# Altium project Cortes.PrjPcb (part 2 of 3)

## Sheet Trinamic.SchDoc
size 420 x 297 mm; SheetNumber: 8; SheetTotal: 10; PageSetup: Record=PageOptions|CenterHorizontal=True|CenterVertical=True|PrintScale=0.96|XCorrection=1.00|YCorrection=1.00|PrintKind=1|BorderSize=5000000|LeftOffset=0|BottomOffset=0|Orientation=2|PaperLength=4318|PaperWidth=2794|Scale=100|PaperSource=7|PrintQuality=600|MediaType=1|DitherType=10|PaperKind=11" x 17"|PrintScaleMode=1
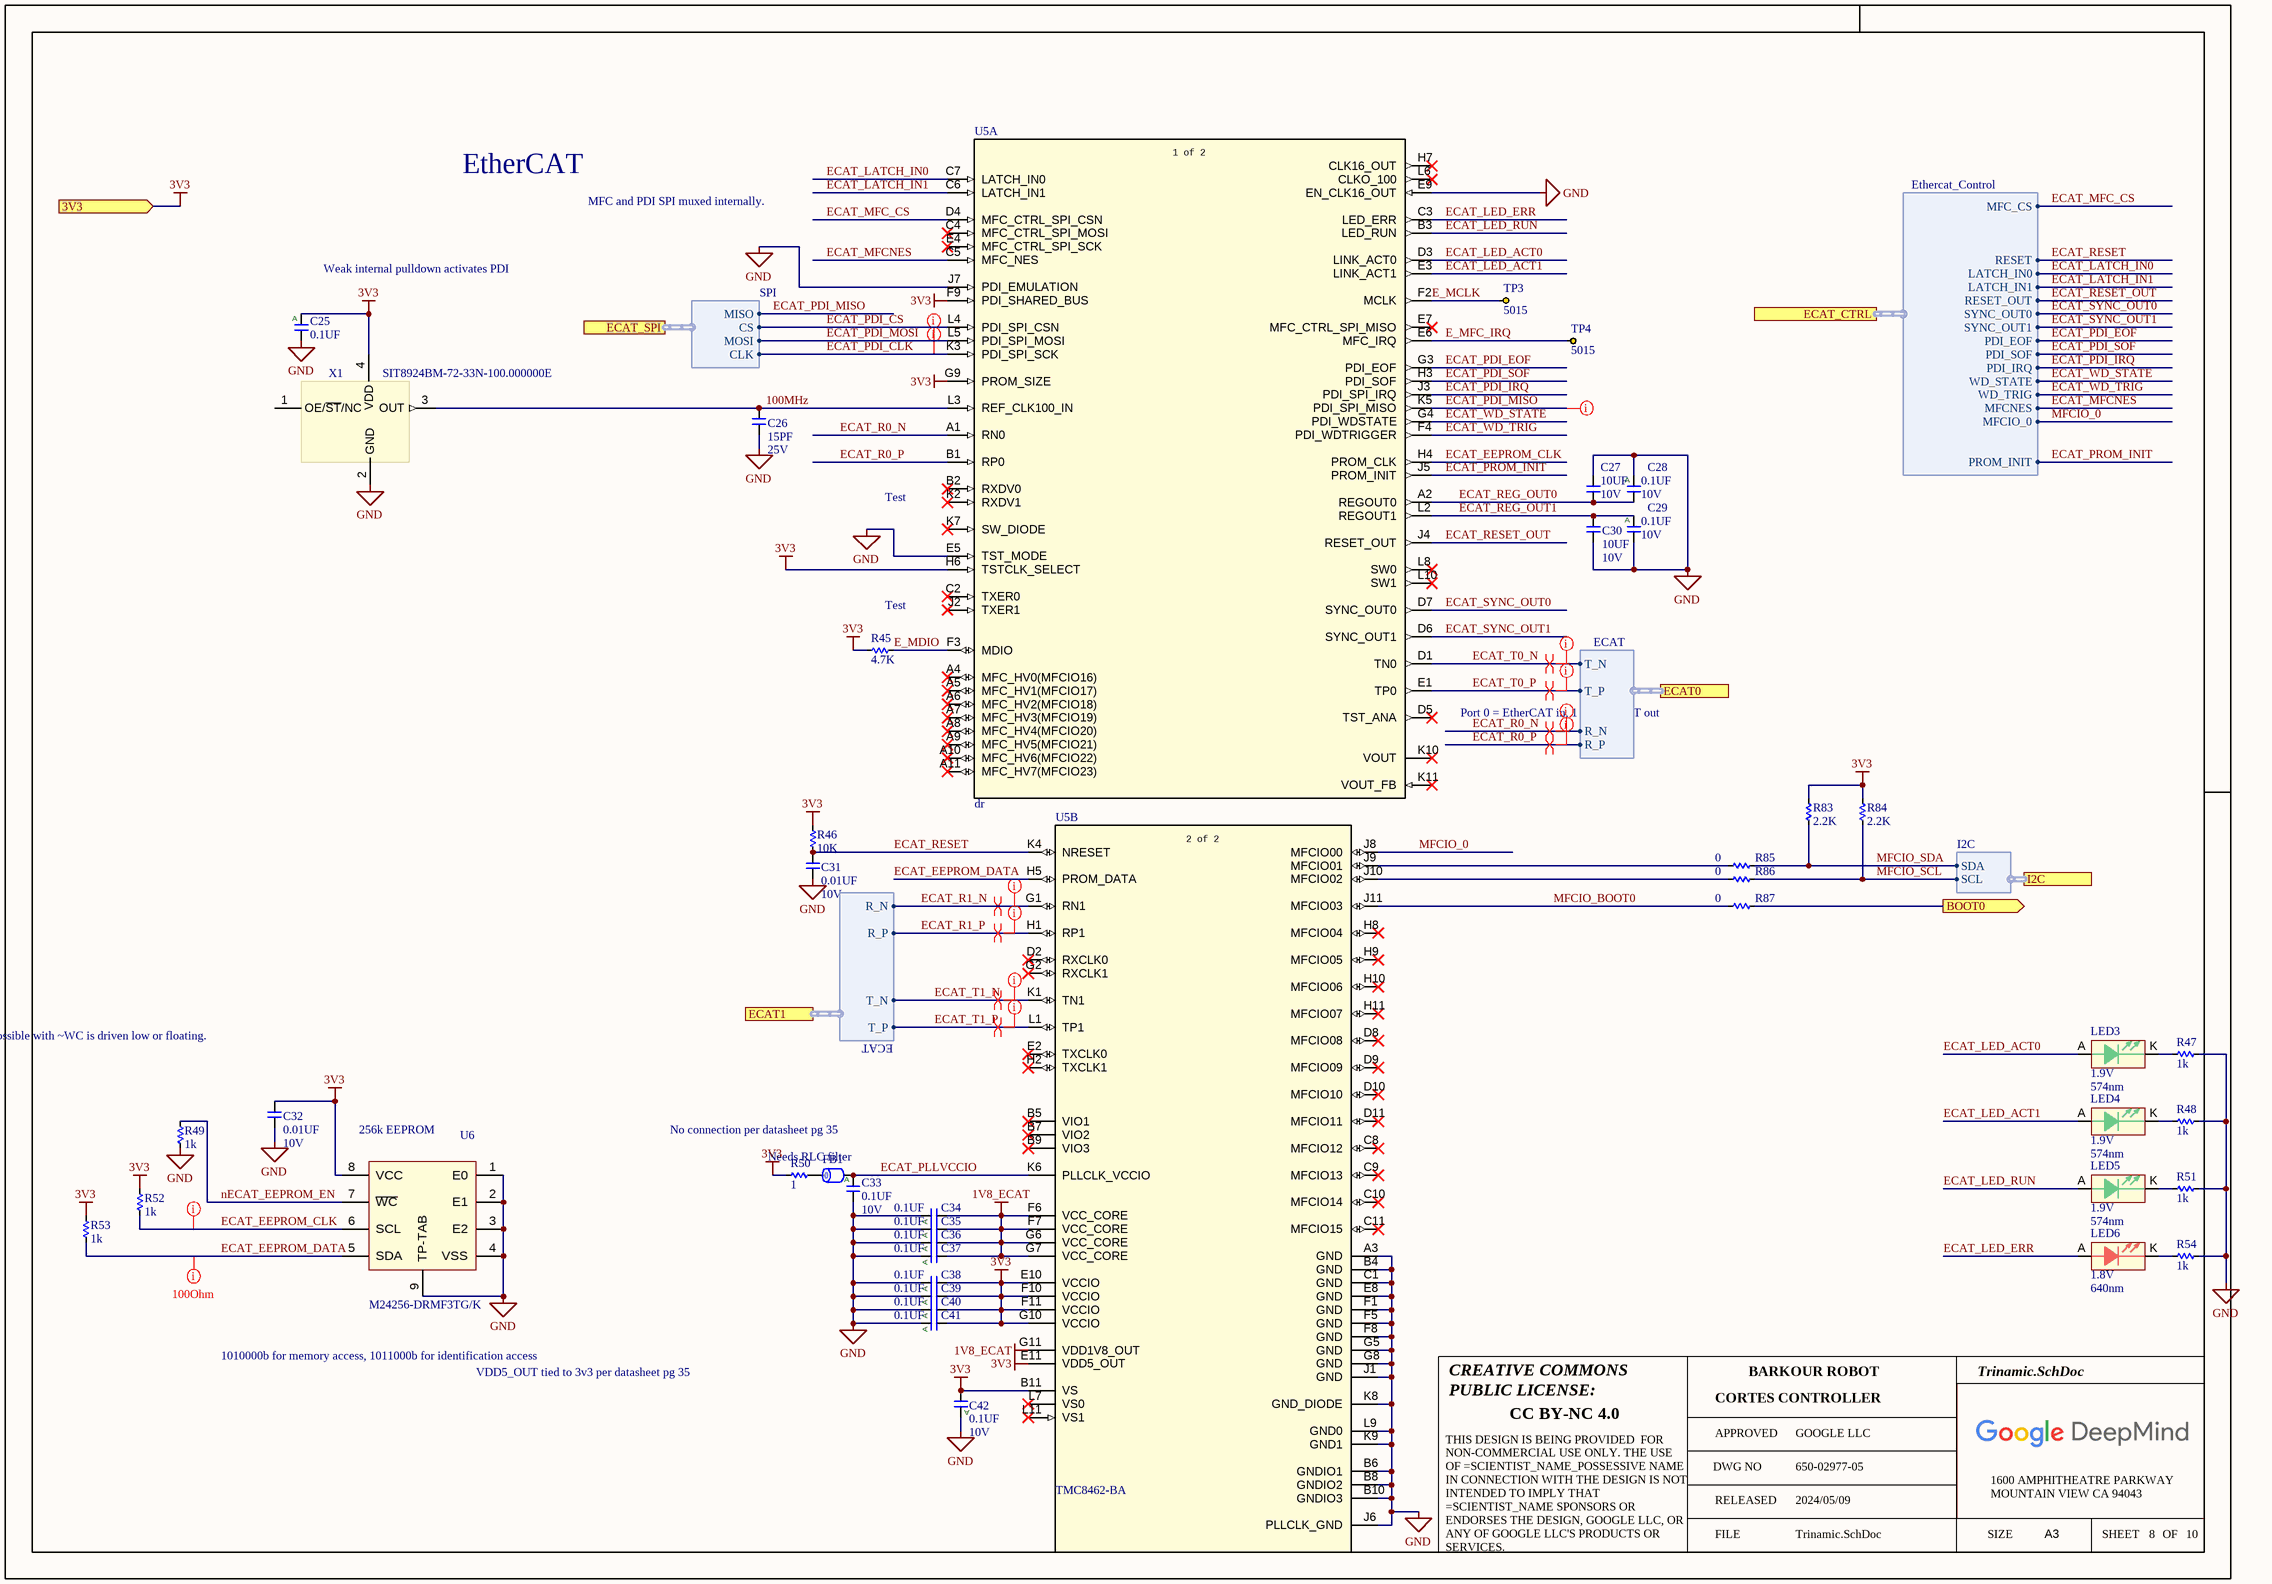
[diagram p4: Trinamic.SchDoc]

### Parts
C25  value 0.1UF  [C0201Y]  (hidden comment: __Template_Cap_Auto)
C26  value 15PF  Voltage: 25V  [C0201]  (hidden comment: __Template_Cap)
C27  value 10UF  Voltage: 10V  [C0402]  (hidden comment: __Template_Cap)
C28  value 0.1UF  Voltage: 10V  [C0201Y]  (hidden comment: __Template_Cap_Auto)
C29  value 0.1UF  Voltage: 10V  [C0201Y]  (hidden comment: __Template_Cap_Auto)
C30  value 10UF  Voltage: 10V  [C0402]  (hidden comment: __Template_Cap)
C31  value 0.01UF  Voltage: 10V  [C0201Y]  (hidden comment: __Template_Cap)
C32  value 0.01UF  Voltage: 10V  [C0201Y]  (hidden comment: __Template_Cap)
C33  value 0.1UF  Voltage: 10V  [C0201Y]  (hidden comment: __Template_Cap_Auto)
C34  value 0.1UF  [C0201Y]  (hidden comment: __Template_Cap_Auto)
C35  value 0.1UF  [C0201Y]  (hidden comment: __Template_Cap_Auto)
C36  value 0.1UF  [C0201Y]  (hidden comment: __Template_Cap_Auto)
C37  value 0.1UF  [C0201Y]  (hidden comment: __Template_Cap_Auto)
C38  value 0.1UF  [C0201Y]  (hidden comment: __Template_Cap_Auto)
C39  value 0.1UF  [C0201Y]  (hidden comment: __Template_Cap_Auto)
C40  value 0.1UF  [C0201Y]  (hidden comment: __Template_Cap_Auto)
C41  value 0.1UF  [C0201Y]  (hidden comment: __Template_Cap_Auto)
C42  value 0.1UF  Voltage: 10V  [C0201Y]  (hidden comment: __Template_Cap_Auto)
FB1  __Template_Ferrite_Bead  [L0201_H0.33MM]  (value not drawn)
LED3  Voltage – Forward (VF) (MAX) @ IF: 1.9V  Color / Wavelength: 574nm  [LED_APHHS1005LCGCK]  (hidden comment: __Template_LED_GREEN_AK)
LED4  Voltage – Forward (VF) (MAX) @ IF: 1.9V  Color / Wavelength: 574nm  [LED_APHHS1005LCGCK]  (hidden comment: __Template_LED_GREEN_AK)
LED5  Voltage – Forward (VF) (MAX) @ IF: 1.9V  Color / Wavelength: 574nm  [LED_APHHS1005LCGCK]  (hidden comment: __Template_LED_GREEN_AK)
LED6  Voltage – Forward (VF) (MAX) @ IF: 1.8V  Color / Wavelength: 640nm  [LED_APHHS1005LCGCK]  (hidden comment: __Template_LED_RED_AK)
R45  value 4.7K  [R0201_H0.26MM]  (hidden comment: __Template_Resistor)
R46  value 10K  [R0201_H0.26MM]  (hidden comment: __Template_Resistor)
R47  value 1k  [R0201_H0.26MM]  (hidden comment: __Template_Resistor)
R48  value 1k  [R0201_H0.26MM]  (hidden comment: __Template_Resistor)
R49  value 1k  [R0201_H0.26MM]  (hidden comment: __Template_Resistor)
R50  value 1  [R0201]
R51  value 1k  [R0201_H0.26MM]  (hidden comment: __Template_Resistor)
R52  value 1k  [R0201_H0.26MM]  (hidden comment: __Template_Resistor)
R53  value 1k  [R0201_H0.26MM]  (hidden comment: __Template_Resistor)
R54  value 1k  [R0201_H0.26MM]  (hidden comment: __Template_Resistor)
R83  value 2.2K  [R0201]
R84  value 2.2K  [R0201]
R85  value 0  [R0402]
R86  value 0  [R0402]
R87  value 0  [R0402]
TP3  MFG P/N: 5015  [KEYSTONE_5015_NS]  (hidden comment: KEYSTONE5015_NOSILK)
TP4  MFG P/N: 5015  [KEYSTONE_5015_NS]  (hidden comment: KEYSTONE5015_NOSILK)
U5  MFG P/N: dr  [BGA121C75P11X11_900X900X145]  (hidden comment: PROCESSOR_TRINAMIC_TMC8462-BA)  (parts A,B of 2)
U6  MFG P/N: M24256-DRMF3TG/K  [8WFDFN300X200X80-8-TP]  (hidden comment: EEPROM_M24256-DRMF3TG/K)
X1  Mfg P/N: SIT8924BM-72-33N-100.000000E  [XTAL_SIT8924BM-72-33N-100.000000]  (hidden comment: XTAL_SIT8924BM-72-33N-100.000000)

### Ports
3V3 (in), BOOT0 (out), ECAT0 (harness ECAT), ECAT1 (harness ECAT), ECAT_CTRL (harness Ethercat_Control), ECAT_SPI (harness SPI), I2C (harness I2C)

### Harnesses
Ethercat_Control: MFC_CS, LATCH_IN0, LATCH_IN1, RESET_OUT, SYNC_OUT0, SYNC_OUT1, PDI_EOF, PDI_SOF, PDI_IRQ, RESET, WD_STATE, WD_TRIG, MFCNES, MFCIO_0, PROM_INIT
SPI: MISO, MOSI, CS, CLK
ECAT: R_P, R_N, T_P, T_N
I2C: SDA, SCL

### Nets
1V8_ECAT: C34.2 C35.2 C36.2 C37.2 U5.F6(VCC_CORE) U5.F7(VCC_CORE) U5.G6(VCC_CORE) U5.G7(VCC_CORE) U5.G11(VDD1V8_OUT)
3V3: C25.1 C32.1 C38.2 C39.2 C40.2 C41.2 C42.2 R45.2 R46.2 R50.1 R52.2 R53.2 R83.2 R84.2 U5.B11(VS) U5.E10(VCCIO) U5.E11(VDD5_OUT) U5.F9(PDI_SHARED_BUS) U5.F10(VCCIO) U5.F11(VCCIO) U5.G9(PROM_SIZE) U5.G10(VCCIO) U5.H6(TSTCLK_SELECT) U6.8(VCC) X1.4(VDD) ; port 3V3
GND: C25.2 C26.2 C27.1 C28.1 C29.2 C30.2 C31.2 C32.2 C33.2 C34.1 C35.1 C36.1 C37.1 C38.1 C39.1 C40.1 C41.1 C42.1 R47.1 R48.1 R49.1 R51.1 R54.1 U5.A3(GND) U5.B4(GND) U5.B6(GNDIO1) U5.B8(GNDIO2) U5.B10(GNDIO3) U5.C1(GND) U5.E5(TST_MODE) U5.E8(GND) U5.E9(EN_CLK16_OUT) U5.F1(GND) U5.F5(GND) U5.F8(GND) U5.G5(GND) U5.G8(GND) U5.J1(GND) U5.J6(PLLCLK_GND) U5.J7(PDI_EMULATION) U5.K8(GND_DIODE) U5.K9(GND1) U5.L9(GND0) U6.1(E0) U6.2(E1) U6.3(E2) U6.4(VSS) U6.9(TP-TAB) X1.2(GND)
100MHz: C26.1 U5.L3(REF_CLK100_IN) X1.3(OUT)
BOOT0: R87.2 ; port BOOT0
E_MCLK: TP3.1 U5.F2(MCLK)
E_MDIO: R45.1 U5.F3(MDIO)
E_MFC_IRQ: TP4.1 U5.E6(MFC_IRQ)
ECAT_EEPROM_CLK: R52.1 U5.H4(PROM_CLK) U6.6(SCL)
ECAT_EEPROM_DATA: R53.1 U5.H5(PROM_DATA) U6.5(SDA)
ECAT_LATCH_IN0: U5.C7(LATCH_IN0) ; port ECAT_CTRL.LATCH_IN0
ECAT_LATCH_IN1: U5.C6(LATCH_IN1) ; port ECAT_CTRL.LATCH_IN1
ECAT_LED_ACT0: LED3.A U5.D3(LINK_ACT0)
ECAT_LED_ACT1: LED4.A U5.E3(LINK_ACT1)
ECAT_LED_ERR: LED6.A U5.C3(LED_ERR)
ECAT_LED_RUN: LED5.A U5.B3(LED_RUN)
ECAT_MFC_CS: U5.D4(MFC_CTRL_SPI_CSN) ; port ECAT_CTRL.MFC_CS
ECAT_MFCNES: U5.C5(MFC_NES) ; port ECAT_CTRL.MFCNES
ECAT_PDI_CLK: U5.K3(PDI_SPI_SCK) ; port ECAT_SPI.CLK
ECAT_PDI_CS: U5.L4(PDI_SPI_CSN) ; port ECAT_SPI.CS
ECAT_PDI_EOF: U5.G3(PDI_EOF) ; port ECAT_CTRL.PDI_EOF
ECAT_PDI_IRQ: U5.J3(PDI_SPI_IRQ) ; port ECAT_CTRL.PDI_IRQ
ECAT_PDI_MISO: U5.K5(PDI_SPI_MISO) ; port ECAT_SPI.MISO
ECAT_PDI_MOSI: U5.L5(PDI_SPI_MOSI) ; port ECAT_SPI.MOSI
ECAT_PDI_SOF: U5.H3(PDI_SOF) ; port ECAT_CTRL.PDI_SOF
ECAT_PLLVCCIO: C33.1 FB1.2 U5.K6(PLLCLK_VCCIO)
ECAT_PROM_INIT: U5.J5(PROM_INIT) ; port ECAT_CTRL.PROM_INIT
ECAT_R0_N: U5.A1(RN0) ; port ECAT0.R_N
ECAT_R0_P: U5.B1(RP0) ; port ECAT0.R_P
ECAT_R1_N: U5.G1(RN1) ; port ECAT1.R_N
ECAT_R1_P: U5.H1(RP1) ; port ECAT1.R_P
ECAT_REG_OUT0: C27.2 C28.2 U5.A2(REGOUT0)
ECAT_REG_OUT1: C29.1 C30.1 U5.L2(REGOUT1)
ECAT_RESET: C31.1 R46.1 U5.K4(NRESET) ; port ECAT_CTRL.RESET
ECAT_RESET_OUT: U5.J4(RESET_OUT) ; port ECAT_CTRL.RESET_OUT
ECAT_SYNC_OUT0: U5.D7(SYNC_OUT0) ; port ECAT_CTRL.SYNC_OUT0
ECAT_SYNC_OUT1: U5.D6(SYNC_OUT1) ; port ECAT_CTRL.SYNC_OUT1
ECAT_T0_N: U5.D1(TN0) ; port ECAT0.T_N
ECAT_T0_P: U5.E1(TP0) ; port ECAT0.T_P
ECAT_T1_N: U5.K1(TN1) ; port ECAT1.T_N
ECAT_T1_P: U5.L1(TP1) ; port ECAT1.T_P
ECAT_WD_STATE: U5.G4(PDI_WDSTATE) ; port ECAT_CTRL.WD_STATE
ECAT_WD_TRIG: U5.F4(PDI_WDTRIGGER) ; port ECAT_CTRL.WD_TRIG
MFCIO_0: U5.J8(MFCIO00) ; port ECAT_CTRL.MFCIO_0  [project net ECAT_MFCIO_0]
MFCIO_BOOT0: R87.1 U5.J11(MFCIO03)
MFCIO_SCL: R84.1 R86.2 ; port I2C.SCL
MFCIO_SDA: R83.1 R85.2 ; port I2C.SDA
nECAT_EEPROM_EN: R49.2 U6.7(~{WC})
NetFB1_1: FB1.1 R50.2
NetLED3_K: LED3.K R47.2
NetLED4_K: LED4.K R48.2
NetLED5_K: LED5.K R51.2
NetLED6_K: LED6.K R54.2
NetR85_1: R85.1 U5.J9(MFCIO01)
NetR86_1: R86.1 U5.J10(MFCIO02)

Not connected (* = marked no-connect by the designer): U5 A4(MFC_HV0(MFCIO16))* A5(MFC_HV1(MFCIO17))* A6(MFC_HV2(MFCIO18))* A7(MFC_HV3(MFCIO19))* A8(MFC_HV4(MFCIO20))* A9(MFC_HV5(MFCIO21))* A10(MFC_HV6(MFCIO22))* A11(MFC_HV7(MFCIO23))* B2(RXDV0)* B5(VIO1)* B7(VIO2)* B9(VIO3)* C2(TXER0)* C4(MFC_CTRL_SPI_MOSI)* C8(MFCIO12)* C9(MFCIO13)* C10(MFCIO14)* C11(MFCIO15)* D2(RXCLK0)* D5(TST_ANA)* D8(MFCIO08)* D9(MFCIO09)* D10(MFCIO10)* D11(MFCIO11)* E2(TXCLK0)* E4(MFC_CTRL_SPI_SCK)* E7(MFC_CTRL_SPI_MISO)* G2(RXCLK1)* H2(TXCLK1)* H7(CLK16_OUT)* H8(MFCIO04)* H9(MFCIO05)* H10(MFCIO06)* H11(MFCIO07)* J2(TXER1)* K2(RXDV1)* K7(SW_DIODE)* K10(VOUT)* K11(VOUT_FB)* L6(CLKO_100)* L7(VS0)* L8(SW0)* L10(SW1)* L11(VS1)*; X1 1(OE/~{ST}/NC)

### Layout directives
net class SE50Ohm: ECAT_PDI_CLK, ECAT_PDI_MISO, ECAT_PDI_MOSI
net class Diff100Ohm: ECAT_R0_N, ECAT_R0_P, ECAT_R1_N, ECAT_R1_P, ECAT_T0_N, ECAT_T0_P, ECAT_T1_N, ECAT_T1_P
differential pair; differential pair class 100Ohm: ECAT_R0_N, ECAT_R0_P, ECAT_R1_N, ECAT_R1_P, ECAT_T0_N, ECAT_T0_P, ECAT_T1_N, ECAT_T1_P
net class SE100Ohm: ECAT_EEPROM_CLK, ECAT_EEPROM_DATA

### Notes on the sheet
- EtherCAT
- (near U5) MFC and PDI SPI muxed internally.
- Weak internal pulldown activates PDI
- (near U5) Test
- Test
- Port 0 = EtherCAT in, 1 = EtherCAT out
- Writes are possible with ~WC is driven low or floating.
- (near U6) 256k EEPROM
- (near U5) No connection per datasheet pg 35
- Needs RLC filter
- 1010000b for memory access, 1011000b for identification access
- VDD5_OUT tied to 3v3 per datasheet pg 35
- CREATIVE COMMONS
- PUBLIC LICENSE:
- BARKOUR ROBOT
- CC BY-NC 4.0
- APPROVED
- DWG NO
- GOOGLE LLC
- FILE
- RELEASED
- 2024/05/09
- SIZE
- 1600 AMPHITHEATRE PARKWAY
- MOUNTAIN VIEW CA 94043
- A3
- SHEET
- OF
- THIS DESIGN IS BEING PROVIDED  FOR NON-COMMERCIAL USE ONLY. THE USE OF =SCIENTIST_NAME_POSSESSIVE NAME IN CONNECTION WITH THE DESIGN IS NOT INTENDED TO IMPLY THAT =SCIENTIST_NAME SPONSORS OR ENDORSES THE DESIGN, GOOGLE LLC, OR ANY OF GOOGLE LLC'S PRODUCTS OR SERVICES.
- (in symbol 113, part A) 1 of 2
- (in symbol 113, part B) 2 of 2
- (in symbol 934) A

### Library data of the parts
C25 C28 C29 C33-C42 = 934: as C11 on sheet Processor; Status: Released; Package: 0201; Dielectric: X6S; Tolerance: 10%; Height: 0.33mm T; Supplier 1: Digi-key; HelpURL: https://www.digikey.com/product-detail/en/murata-electronics/GRT033C81A104KE01D/490-12232-1-ND/5416933; ComponentLink1Description: Datasheet; ComponentLink1URL: https://search.murata.co.jp/Ceramy/image/img/A01X/G101/ENG/GRT033C81A104KE01-01.pdf; COMMON: 150-01178-00; LOON: 150-01178-00; Supplier Part Number 1: 490-12232-1-ND
  C25 C34-C41: Voltage: 10V
C26 = 1033: CAP, CER, NP0, 15pF, 25V, 5%, 0201, 0.9mm T; ID: 1033; MFG: TDK; MFG P/N: C0603C0G1E150J030BA; XPN: 150-00968-00; EES: 150-04578-00; Status: NRND; Package: 0201; Dielectric: NP0; Tolerance: 5%; Height: 0.9mm T; ComponentLink1Description: Datasheet; COMMON: 150-00968-00; LOON: 150-00968-00; Gecko: 150-00968-00
C27 C30 = 215: CAP, CER, X5R, 10uF, 10V, 20%, 0402, 0.7mm T; ID: 215; MFG: SAMSUNG; MFG P/N: CL05A106MP5NUNC; XPN: 150-00376-00; PROXY: Use ID #1342; EES: 150-04565-00; Status: Released; Package: 0402; Dielectric: X5R; Tolerance: 20%; Height: 0.7mm T; ComponentLink1Description: Datasheet; COMMON: 150-00376-00; LOON: 150-00376-00; Gecko: 150-00376-00
C31 C32 = 361: CAP, CER, X7R, 0.01uF, 10V, 10%, AUTO GRADE, 0201, 0.33mm T; ID: 361; MFG: MURATA; MFG P/N: GCM033R71A103KA03D; XPN: 150-01021-00; EES: 150-04564-00; Status: Released; Package: 0201; Dielectric: X7R; Tolerance: 10%; Height: 0.33mm T; ComponentLink1Description: Datasheet; COMMON: 150-01021-00; LOON: 150-01021-00; Gecko: 150-01021-00
FB1 = 867: FERRITE, BEAD, 600OHMS @100MHZ, 25%, 250mA, 900 mOHM DCR, 0201; ID: 867; Catagory: Ferrite Bead; MFG: Murata Electronics North America; MFG P/N: BLM03AX601SN1D; Rdc max: 0.85; Idc max: .25; EES: 185-00325-00; ComponentLink1Description: Datasheet; Status: Released; Package: 0201 (0603 Metric); Supplier 1: Digi-Key; HelpURL: https://www.digikey.in/product-detail/en/murata-electronics-north-america/BLM03AX601SN1D/490-5624-1-ND/2485963; ComponentLink1URL: https://www.murata.com/en-us/products/productdata/8796741140510/ENFA0020.pdf; Height: 0.33mm; Supplier Part Number 1: 490-5624-1-ND
LED3-LED5 = 306: LED, GREEN, 574nm, 2mA, CLEAR, 0402; ID: 306; MFG: Kingbright; MFG P/N: APHHS1005LCGCK; Value: APHHS1005LCGCK; EES: 370-00611-00; Status: Released; Package: 0402; Category: LED; RoHS Compliant: Yes; Diode Type: LED; Mounting Type: SMD; Supplier 1: Digi-Key; HelpURL: https://www.digikey.com/product-detail/en/kingbright/APHHS1005LCGCK/754-2121-1-ND/7319049; ComponentLink1Description: Datasheet; ComponentLink1URL: http://www.kingbrightusa.com/images/catalog/SPEC/APHHS1005LCGCK.pdf; Height: 0.6mm; Supplier Part Number 1: 754-2121-1-ND
LED6 = 309: LED, RED, 640NM, 2mA, CLEAR, 0402; ID: 309; MFG: Kingbright; MFG P/N: APHHS1005LSECK/J3-PF; Value: APHHS1005LSECK/J3-PF; EES: 370-00614-00; Status: Released; Package: 0402; Category: LED; RoHS Compliant: Yes; Diode Type: LED; Mounting Type: SMD; Supplier 1: Digi-Key; HelpURL: https://www.digikey.com/product-detail/en/kingbright/APHHS1005LSECK-J3-PF/754-2123-1-ND/7319051; ComponentLink1Description: Datasheet; ComponentLink1URL: http://www.kingbrightusa.com/images/catalog/SPEC/APHHS1005LSECK-J3-PF.pdf; Height: 0.6mm; Supplier Part Number 1: 754-2123-1-ND
R45 = 10025: RES, 4.7K, 1%, 1/20W, 0201, AUTOGRADE; ID: 10025; MFG: Panasonic Electronic Components; MFG P/N: ERJ-1GNF4701C; Catagory: Chip Resistor - Surface Mount; Power: 0.05W, 1/20W; EES: 470-18032-00; Status: Released; Package: 0201; Tolerance: 1%; Height: 0.26mm; Supplier 1: Digi-Key; HelpURL: https://www.digikey.in/product-detail/en/panasonic-electronic-components/ERJ-1GNF4701C/P123031CT-ND/8343001; ComponentLink1Description: Datasheet; ComponentLink1URL: https://industrial.panasonic.com/cdbs/www-data/pdf/RDA0000/AOA0000C304.pdf; Supplier Part Number 1: P123031CT-ND
R46 = 6783: as R9 on sheet Processor; Status: Released; Package: 0201; Power: 1/20W; Tolerance: 1%; Height: 0.26mm; Supplier 1: Digi-Key; HelpURL: https://www.digikey.in/product-detail/en/panasonic-electronic-components/ERJ-1GNF1002C/P122414CT-ND/7389440; ComponentLink1Description: Datasheet; ComponentLink1URL: https://industrial.panasonic.com/cdbs/www-data/pdf/RDA0000/AOA0000C304.pdf; LOON: 470-00033-00; Gecko: 470-00033-00; XPN: 470-00033-00; Supplier Part Number 1: P122414CT-ND
R47-R49 R51-R54 = 10010: RES, 1K, 1%, 1/20W, 0201, AUTOGRADE; ID: 10010; MFG: Bourns Inc.; MFG P/N: CR0201AFW-1001GLF; Power: 0.05W, 1/20W; Catagory: Chip Resistor - Surface Mount; EES: 470-18022-00; Status: Released; Package: 0201; Tolerance: 1%; Height: 0.26mm; Supplier 1: Digi-Key; HelpURL: https://www.digikey.in/product-detail/en/bourns-inc/CR0201AFW-1001GLF/118-CR0201AFW-1001GLFCT-ND/12091423; ComponentLink1Description: Datasheet; ComponentLink1URL: https://www.bourns.com/docs/product-datasheets/crxxxxa.pdf; Supplier Part Number 1: 118-CR0201AFW-1001GLFCT-ND
R50 = 7413: RES, 1.0, 5%, 1/20W, 0201; ID: 7413; MFG: PANASONIC; MFG P/N: ERJ1GEJ1R0C; COMMON: 470-02088-00; EES: 470-17951-00; Status: NRND; Package: 0201; Power: 1/20W; Tolerance: 5%; LOON: 470-02088-00; Gecko: 470-02088-00; XPN: 470-02088-00
R83 R84 = 3569: Resistor, 2.20K Ohms, 0201, 0.05W, ±1%; ID: 3569; MFG: PANASONIC; MFG P/N: ERJ-1GEF2201C; Power: 1/20W; COMMON: 470-01004-00; Status: NRND; Package: 0201; Tolerance: 1%; Height: 0.26mm; Supplier 1: Digi-Key; XPN: 470-01004-00; Supplier Part Number 1: P2.20KABCT-ND
R85-R87 = 8004: RES, 0, JUMPER, 1/16W, 0402; ID: 8004; MFG: YAGEO; MFG P/N: RC0402FR-070RL; COMMON: 470-02332-00; PROXY: Use ID #2; Gecko: 470-17892-00; Status: Released; Package: 0402; Power: 1/16W; Tolerance: JUMPER; XPN: 470-02332-00
TP3 TP4 = 176: HW, TEST POINT, NO SILKSCREEN, PC MINIATURE, 0.25mm T, 1.52mm HEIGHT, SILVER PLATING, SMT; ID: 176; MFG: Keystone Electronics Corp.; COMMON: 250-00207-00; PROXY: 250-04113-00; KOI: 250-07313-00; XPN: XS-10008125; EES: 250-08552-00; EPIC: 250-08204-00; Status: In Development; Category: Test and Measurement; Supplier 1: Digi-Key; Height: 1.65mm; Mounting Type: SMD; HelpURL: https://www.digikey.com/product-detail/en/keystone-electronics/5015/36-5015CT-ND/278886; ComponentLink1Description: Datasheet; ComponentLink1URL: http://keyelco.com/userAssets/file/M65p55.pdf; LOON: 250-00207-00; Gecko: 250-00207-00; Supplier Part Number 1: 36-5015CT-ND
U5 = 113: IC, CONTROLLER, TMC8462, ETHERNET, 100Mb, SPI, PWM O/P, 100mA, BGA-121; ID: 113; MFG: Trinamic Motion Control GmbH; EES: 313-05813-00; Status: Released; Package: 121-BGA (9x9); Category: Integrated Circuits (ICs); RoHS Compliant: Yes; Supplier 1: Digi-Key; HelpURL: https://www.digikey.com/products/en?keywords=TMC8462-BA; ComponentLink1Description: Datasheet; ComponentLink1URL: https://www.trinamic.com/products/integrated-circuits/details/tmc8462-ba/; Height: 1.4mm; Supplier Part Number 1: 1460-1258-ND
U6 = 423: IC, MEMORY, M24256, EEPROM, 256Kb, I2C, 1MHz, MLP-8, AUTOGRADE; ID: 423; MFG: STMicroelectronics; EES: 313-05803-00; Status: Released; Package: 8-WFDFN; Category: Integrated Circuits (ICs); RoHS Compliant: Yes; Supplier 1: Digi-Key; ComponentLink1Description: Datasheet; ComponentLink1URL: https://www.st.com/content/ccc/resource/technical/document/datasheet/a7/9b/dd/87/57/59/41/8c/DM00061669.pdf/files/DM00061669.pdf/jcr:content/translations/en.DM00061669.pdf; Mounting Type: SMD; Height: 0.8mm; Supplier Part Number 1: 497-15355-6-ND; HelpURL: https://www.digikey.com/product-detail/en/stmicroelectronics/M24256-DRMF3TG-K/497-15355-6-ND/5175353
X1 = 137: OSC, MEMS, XO, 100MHZ, +/-25PPM STAB, LVCMOS, 3.3V, SMD-4, AUTOGRADE; ID: 137; Mfg: SiTIME; Current - Supply (Max): 4.8mA; Frequency Stability: ±25ppm; Output: LVCMOS, LVTTL; EES: 230-00460-00; Status: Released; Package: 4-SMD, No Lead; Category: Crystals and Oscillators; RoHS Compliant: Yes; Mounting Type: SMD; Supplier 1: Digi-Key; Frequency: 100MHz; Height: 0.8mm; Operating Temperature: -55°C ~ 125°C; Type: XO (Standard); Voltage – Supply: 3.3V; HelpURL: https://www.digikey.com/product-detail/en/sitime/SIT8924BM-72-33N-100-000000E/1473-SIT8924BM-72-33N-100-000000E-ND/11292440; ComponentLink1Description: Datasheet; ComponentLink1URL: https://source.z2data.com/2019/9/26/1/9/50/497/69995916/SiT8924.pdf; Supplier Part Number 1: 1473-SIT8924BM-72-33N-100.000000E-ND

## Sheet Power.SchDoc
size 420 x 297 mm; SheetNumber: 4; SheetTotal: 10; PageSetup: Record=PageOptions|CenterHorizontal=True|CenterVertical=True|PrintScale=0.96|XCorrection=1.00|YCorrection=1.00|PrintKind=1|BorderSize=5000000|LeftOffset=0|BottomOffset=0|Orientation=2|PaperLength=4318|PaperWidth=2794|Scale=100|PaperSource=7|PrintQuality=600|MediaType=1|DitherType=10|PaperKind=11" x 17"|PrintScaleMode=1
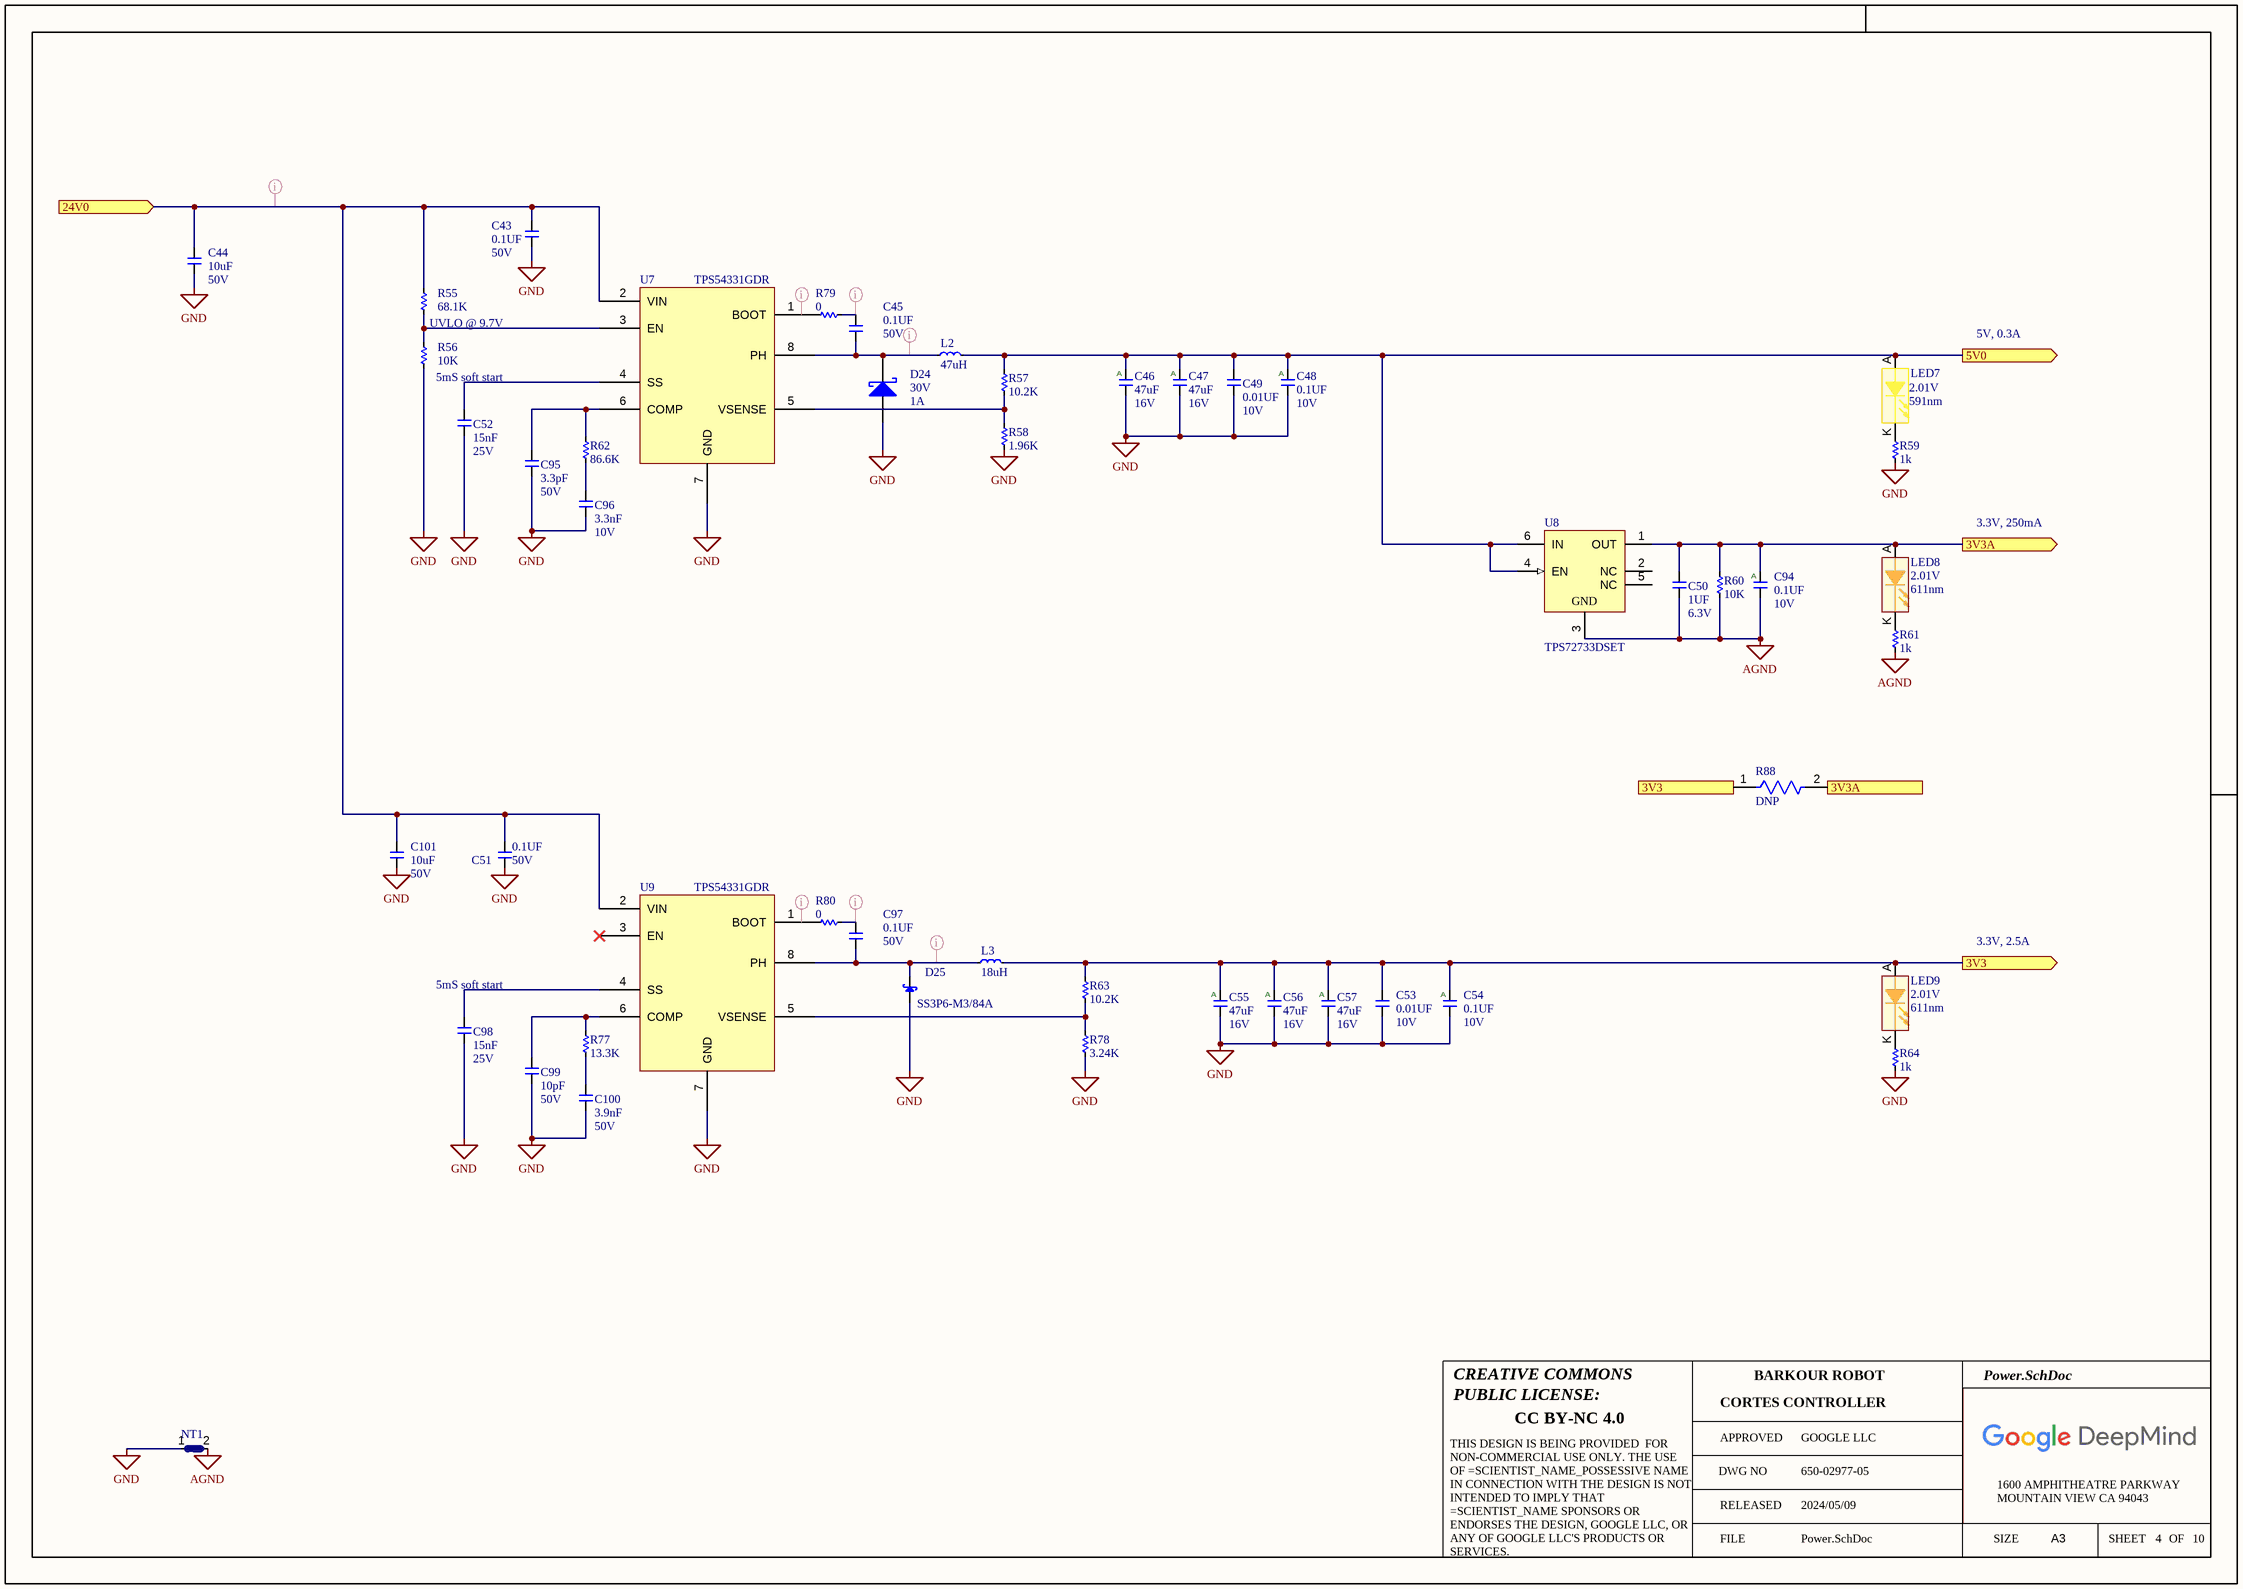
[diagram p5: Power.SchDoc]

### Parts
C43  value 0.1UF  Voltage: 50V  [C0402]  (hidden comment: __Template_Cap)
C44  value 10uF  Voltage: 50V  [C1210_H2.7mm]  (hidden comment: __Template_Cap)
C45  value 0.1UF  Voltage: 50V  [C0402]  (hidden comment: __Template_Cap)
C46  value 47uF  Voltage: 16V  [C2220]  (hidden comment: __Template_Cap_Auto)
C47  value 47uF  Voltage: 16V  [C2220]  (hidden comment: __Template_Cap_Auto)
C48  value 0.1UF  Voltage: 10V  [C0201Y]  (hidden comment: __Template_Cap_Auto)
C49  value 0.01UF  Voltage: 10V  [C0201Y]  (hidden comment: __Template_Cap)
C50  value 1UF  Voltage: 6.3V  [C0201]  (hidden comment: __Template_Cap)
C51  value 0.1UF  Voltage: 50V  [C0402]  (hidden comment: __Template_Cap)
C52  value 15nF  Voltage: 25V  [C0402]  (hidden comment: __Template_Cap)
C53  value 0.01UF  Voltage: 10V  [C0201Y]  (hidden comment: __Template_Cap)
C54  value 0.1UF  Voltage: 10V  [C0201Y]  (hidden comment: __Template_Cap_Auto)
C55  value 47uF  Voltage: 16V  [C2220]  (hidden comment: __Template_Cap_Auto)
C56  value 47uF  Voltage: 16V  [C2220]  (hidden comment: __Template_Cap_Auto)
C57  value 47uF  Voltage: 16V  [C2220]  (hidden comment: __Template_Cap_Auto)
C94  value 0.1UF  Voltage: 10V  [C0201Y]  (hidden comment: __Template_Cap_Auto)
C95  value 3.3pF  Voltage: 50V  [C0201Y]  (hidden comment: __Template_Cap)
C96  value 3.3nF  Voltage: 10V  [C0201]  (hidden comment: __Template_Cap)
C97  value 0.1UF  Voltage: 50V  [C0402]  (hidden comment: __Template_Cap)
C98  value 15nF  Voltage: 25V  [C0402]  (hidden comment: __Template_Cap)
C99  value 10pF  Voltage: 50V  [C0201Y]  (hidden comment: __Template_Cap)
C100  value 3.9nF  Voltage: 50V  [C0402]  (hidden comment: __Template_Cap)
C101  value 10uF  Voltage: 50V  [C1210_H2.7mm]  (hidden comment: __Template_Cap)
D24  Voltage - DC Reverse (VR) (MAX): 30V  Current - Average Rectified (IO): 1A  [SOD-123_H1.35MM]  (hidden comment: __Template_DIODE_SCHOTTKY)
D25  value SS3P6-M3/84A  [DO-220AA_A/K]  (hidden comment: __Template_Diode_Schottky_A/K)
L2  Inductance: 47uH  [IND_LPS3015-152MRB]  (hidden comment: COILCRAFT_LPS3015-473)
L3  Inductance: 18uH  [INDP100100X51N]  (hidden comment: BOURNS_SRR1050A-180Y)
LED7  Voltage – Forward (VF) (MAX) @ IF: 2.01V  Color / Wavelength: 591nm  [LED_APG0603SYC-TT]  (hidden comment: __Template_LED_YELLOW_AK)
LED8  Voltage – Forward (VF) (MAX) @ IF: 2.01V  Color / Wavelength: 611nm  [LED_APG0603SYC-TT]  (hidden comment: __Template_LED_ORANGE_AK)
LED9  Voltage – Forward (VF) (MAX) @ IF: 2.01V  Color / Wavelength: 611nm  [LED_APG0603SYC-TT]  (hidden comment: __Template_LED_ORANGE_AK)
NT1  _Template_NETTIE  [NETTIE_0402]  (value not drawn)  (net tie, no BOM)
R55  value 68.1K  [R0201_H0.26MM]  (hidden comment: __Template_Resistor)
R56  value 10K  [R0201_H0.26MM]  (hidden comment: __Template_Resistor)
R57  value 10.2K  [R0201]
R58  value 1.96K  [R0201]
R59  value 1k  [R0201_H0.26MM]  (hidden comment: __Template_Resistor)
R60  value 10K  [R0201_H0.26MM]  (hidden comment: __Template_Resistor)
R61  value 1k  [R0201_H0.26MM]  (hidden comment: __Template_Resistor)
R62  value 86.6K  [R0201]
R63  value 10.2K  [R0201]
R64  value 1k  [R0201_H0.26MM]  (hidden comment: __Template_Resistor)
R77  value 13.3K  [R0201]
R78  value 3.24K  [R0201]
R79  value 0  [R0402]
R80  value 0  [R0402]
R88  DNP  [FP-CRCW0402-e3-IPC_C]
U7  Manufacturer Part Number: TPS54331GDR  [SOIC127P600X175-8N]  (hidden comment: TI_TPS54331GDR)
U8  TPS72733DSET  [DES0006A_V]
U9  Manufacturer Part Number: TPS54331GDR  [SOIC127P600X175-8N]  (hidden comment: TI_TPS54331GDR)

### Ports
3V3 (out), 3V3A (out), 5V0 (out), 24V0 (in)

### Nets
3V3: C53.1 C54.1 C55.1 C56.1 C57.1 L3.2 LED9.A R63.2 R88.1 ; port 3V3
3V3A: C50.1 C94.1 LED8.A R60.2 R88.2 U8.1(OUT) ; port 3V3A
5V0: C46.1 C47.1 C48.1 C49.1 L2.2 LED7.A R57.2 U8.4(EN) U8.6(IN) ; port 5V0
AGND: C50.2 C94.2 NT1.2 R60.1 R61.2 U8.3(GND)
GND: C43.2 C44.2 C46.2 C47.2 C48.2 C49.2 C51.2 C52.2 C53.2 C54.2 C55.2 C56.2 C57.2 C95.2 C96.2 C98.2 C99.1 C100.2 C101.2 D24.A D25.A NT1.1 R56.1 R58.1 R59.2 R64.2 R78.1 U7.7(GND) U9.7(GND)
24V0: C43.1 C44.1 C51.1 C101.1 R55.2 U7.2(VIN) U9.2(VIN) ; port 24V0
NetC45_1: C45.1 R79.2
NetC45_2: C45.2 D24.K L2.1 U7.8(PH)
NetC52_1: C52.1 U7.4(SS)
NetC95_1: C95.1 R62.2 U7.6(COMP)
NetC96_1: C96.1 R62.1
NetC97_1: C97.1 R80.2
NetC97_2: C97.2 D25.K L3.1 U9.8(PH)
NetC98_1: C98.1 U9.4(SS)
NetC99_2: C99.2 R77.2 U9.6(COMP)
NetC100_1: C100.1 R77.1
NetLED7_K: LED7.K R59.1
NetLED8_K: LED8.K R61.1
NetLED9_K: LED9.K R64.1
NetR55_1: R55.1 R56.2 U7.3(EN)
NetR57_1: R57.1 R58.2 U7.5(VSENSE)
NetR63_1: R63.1 R78.2 U9.5(VSENSE)
NetR79_1: R79.1 U7.1(BOOT)
NetR80_1: R80.1 U9.1(BOOT)

Not connected (* = marked no-connect by the designer): U8 2(NC) 5(NC); U9 3(EN)*

### Layout directives
net class 24V: 24V0, (no net found under the mark), NetC45_1, NetC45_2, NetC97_1, NetC97_2

### Notes on the sheet
- UVLO @ 9.7V
- 5mS soft start
- 5V, 0.3A
- 3.3V, 250mA
- 3.3V, 2.5A
- CREATIVE COMMONS
- PUBLIC LICENSE:
- BARKOUR ROBOT
- CC BY-NC 4.0
- APPROVED
- DWG NO
- GOOGLE LLC
- FILE
- RELEASED
- 2024/05/09
- SIZE
- 1600 AMPHITHEATRE PARKWAY
- MOUNTAIN VIEW CA 94043
- A3
- SHEET
- OF
- THIS DESIGN IS BEING PROVIDED  FOR NON-COMMERCIAL USE ONLY. THE USE OF =SCIENTIST_NAME_POSSESSIVE NAME IN CONNECTION WITH THE DESIGN IS NOT INTENDED TO IMPLY THAT =SCIENTIST_NAME SPONSORS OR ENDORSES THE DESIGN, GOOGLE LLC, OR ANY OF GOOGLE LLC'S PRODUCTS OR SERVICES.
- (in symbol 163) A
- (in symbol 934) A

### Library data of the parts
C43 C45 C51 C97 = 1762: CAP, CER, X5R, 0.1uF, 10%, 50V, 0402, 0.55mm; ID: 1762; MFG: YAGEO; MFG P/N: CC0402KRX5R9BB104; EPIC: G150-02449-00; EES: 150-04581-00; Status: Released; Package: 0402; Dielectric: X5R; Tolerance: 10%; Height: 0.55mm; Supplier 1: Digi-Key; HelpURL: https://www.digikey.com/product-detail/en/yageo/CC0402KRX5R9BB104/311-3342-1-ND/6818312; ComponentLink1Description: Datasheet; ComponentLink1URL: http://www.yageo.com/documents/recent/UPY-GPHC_X5R_4V-to-50V_25.pdf; Supplier Part Number 1: 311-3342-1-ND
C44 C101 = 1813: CAP, CER, X5R, 10uF, 50V, 20%, 1210; ID: 1813; MFG: TAIYO YUDEN; MFG P/N: UMK325BJ106MM-T; Gecko: 150-04488-00; EES: 150-04569-00; Status: Released; Package: 1210; Dielectric: X5R; Tolerance: 20%; Height: 2.7mm; Supplier 1: Digi-Key; HelpURL: https://www.digikey.com/product-detail/en/taiyo-yuden/UMK325BJ106MM-T/587-2225-1-ND/2002923; ComponentLink1Description: Datasheet; ComponentLink1URL: https://media.digikey.com/pdf/Data%20Sheets/Taiyo%20Yuden%20PDFs%20URL%20links/UMK325BJ106MM-T_Spec.pdf; Supplier Part Number 1: 587-2225-1-ND
C46 C47 C55-C57 = 163: CAP, CER, X7R, 47uF, 16V, 20%, AUTO GRADE, 2220, 2.5mm T; ID: 163; MFG: TDK; MFG P/N: CGA9N3X7R1C476M230KB; XPN: 150-00499-00; Status: Released; Package: 2220; Dielectric: X7R; Tolerance: 20%; Height: 2.5mm T; ComponentLink1Description: Datasheet; COMMON: 150-00499-00
C48 C54 C94 = 934: as C11 on sheet Processor; Status: Released; Package: 0201; Dielectric: X6S; Tolerance: 10%; Height: 0.33mm T; Supplier 1: Digi-key; HelpURL: https://www.digikey.com/product-detail/en/murata-electronics/GRT033C81A104KE01D/490-12232-1-ND/5416933; ComponentLink1Description: Datasheet; ComponentLink1URL: https://search.murata.co.jp/Ceramy/image/img/A01X/G101/ENG/GRT033C81A104KE01-01.pdf; COMMON: 150-01178-00; LOON: 150-01178-00; Supplier Part Number 1: 490-12232-1-ND
C49 C53 = 361: as C31 on sheet Trinamic; Status: Released; Package: 0201; Dielectric: X7R; Tolerance: 10%; Height: 0.33mm T; ComponentLink1Description: Datasheet; COMMON: 150-01021-00; LOON: 150-01021-00; Gecko: 150-01021-00
C50 = 240: CAP, CER, X5R, 1uF, 6.3V, 20%, 0201, 0.33mm T; ID: 240; MFG: SAMSUNG; MFG P/N: CL03A105MQ3CSNC; XPN: 150-00980-00; EPIC: G150-00980-00; EES: 150-04572-00; Status: Released; Package: 0201; Dielectric: X5R; Tolerance: 20%; Height: 0.35mm; ComponentLink1Description: Datasheet; COMMON: 150-00980-00; LOON: 150-00980-00; Gecko: 150-00980-00
C52 C98 = 838: CAP, CER, X7R, 0.015uF, 25V, 10%, 0402, 0.56mm T; ID: 838; MFG: MURATA; MFG P/N: GRM155R71E153KA61D; XPN: 150-00741-00; Status: NRND; Package: 0402; Dielectric: X7R; Tolerance: 10%; Height: 0.56mm T; ComponentLink1Description: Datasheet; COMMON: 150-00741-00
C95 = 589: CAP, CER, NP0, 3.3pF, 50V, +/-0.25pF, 0201, 0.33mm T; ID: 589; MFG: MURATA; MFG P/N: GRM0335C1H3R3CA01D; Tolerance: 0.25pF; XPN: 150-00958-00; Status: Released; Package: 0201; Dielectric: NP0; Height: 0.33mm T; ComponentLink1Description: Datasheet; COMMON: 150-00958-00
C96 = 343: CAP, CER, X5R, 3300pF, 10V, 10%, 0201, 0.33mm T; ID: 343; MFG: AVX; MFG P/N: 0201ZD332KAT2A; XPN: 150-00555-00; Status: Released; Package: 0201; Dielectric: X5R; Tolerance: 10%; Height: 0.33mm T; ComponentLink1Description: Datasheet; COMMON: 150-00555-00
C99 = 49: CAP, CER, NP0, 10pf, 50V, 5%, 0201, 0.33mm T; ID: 49; MFG: MURATA; MFG P/N: GRM0335C1H100JA01J; XPN: 150-00985-00; Status: Released; Package: 0201; Dielectric: NP0; Tolerance: 5%; Height: 0.33mm T; ComponentLink1Description: Datasheet; COMMON: 150-00985-00
C100 = 377: CAP, CER, X7R, 3900pF, 50V, 10%, 0402, 0.56mm T; ID: 377; MFG: MURATA; MFG P/N: GRM155R71H392KA01D; XPN: 150-00747-00; Status: NRND; Package: 0402; Dielectric: X7R; Tolerance: 10%; Height: 0.56mm T; ComponentLink1Description: Datasheet; COMMON: 150-00747-00
D24 = 290: DIODE, SCHOTTKY, 30V VRRM, 1A IO, 12A SURGE, SOD-123; ID: 290; MFG: Diodes Incorporated; MFG P/N: B130LAW-7-F; Value: B130LAW-7-F; Voltage – Forward (VF) (MAX) @ IF: 420mV @ 1A; Current - Reverse Leakage @ VR: 1mA @ 30V; Gecko: 480-01710-00; Status: Released; Package: SOD-123; Category: Diode; RoHS Compliant: Yes; Diode Type: Schottky; Mounting Type: SMD; Operating Temperature – Junction: -55°C ~ 125°C; Supplier 1: Digi-Key; HelpURL: https://www.digikey.com/product-detail/en/diodes-incorporated/B130LAW-7-F/B130LAW-FDICT-ND/725052; ComponentLink1Description: Datasheet; ComponentLink1URL: https://www.diodes.com/assets/Datasheets/ds30308.pdf; Height: 1.35mm; Supplier Part Number 1: B130LAW-FDICT-ND
D25 = 35: DIODE, SCHOTTKY, 60V, 3A, DO220AA; ID: 35; MFG: VISHAY; Voltage – Forward (VF) (MAX) @ IF: 780mV @ 3A; Current - Reverse Leakage @ VR: 100µA @ 60V; COMMON: 480-00844-00; XPN: XS-10020789; Status: Released; MFG P/N: SS3P6-M3/84A; Package: DO220AA; Category: Diode; Diode Type: SCHOTTKY; Mounting Type: SM; Voltage - DC Reverse (VR) (MAX): 60V; Current - Average Rectified (IO): 3A; Operating Temperature – Junction: -55°C ~ 150°C; Supplier 1: Digi-Key; HelpURL: http://www.vishay.com/docs/88997/ss3p5.pdf; ComponentLink1Description: Datasheet; ComponentLink1URL: http://www.vishay.com/docs/88997/ss3p5.pdf; Supplier Part Number 1: SS3P6-M3/84AGICT-ND
L2 = COILCRAFT_LPS3015-473: COILCRAFT   LPS3015-473MRB   INDUCTOR, SHLD, 47UH, 20%, 0.3A, SMD; RMS Current (Irms): 300mA; Saturation Current: 380mA; DC Resistance (DCR): 1.55R; Supplier 1: Mouser; Supplier Part Number 1: 994-LPS3015-473MRB; Manufacturer: Coilcraft; Manufacturer Part Number: LPS3015-473MRB; RoHS: Yes; Category: Inductors; Mount: Surface Mount; Inductance Tolerance: 20%; Packaging: Cut Tape; REACH SVHC: No SVHC; RoHS Compliant: Yes; ComponentLink1URL: http://www.farnell.com/datasheets/1805321.pdf?src-supplier=Farnell; ComponentLink1Description: http://www.farnell.com/datasheets/1805321.pdf?src-supplier=Farnell; ComponentLink2URL: http://www.farnell.com/datasheets/1805321.pdf?src-supplier=Element14; ComponentLink2Description: http://www.farnell.com/datasheets/1805321.pdf?src-supplier=Element14
L3 = BOURNS_SRR1050A-180Y: FIXED IND 18UH 3.1A 51 MOHM SMD; Manufacturer: Bourns; Saturation Current: 3.2A; DC Resistance (DCR): 51mR; Inductance Tolerance: 30%; Supplier 1: Digi-Key; Supplier Part Number 1: SRR1050A-180YCT-ND; Manufacturer Part Number: SRR1050A-180Y; RoHS: Yes; Category: Fixed Inductors; Stock 1: 545; Pricing 1: 1=1.31000, 10=1.21900, 25=1.12520, 50=0.93780, 100=0.88150, 250=0.78772 (USD); Mount: Surface Mount; RMS Current (Irms): 3.1A; Packaging: Cut Tape; REACH SVHC: No SVHC; RoHS Compliant: Yes; ComponentLink1URL: https://www.bourns.com/docs/Product-Datasheets/SRR1050A.pdf?src-supplier=Digi-Key; ComponentLink1Description: https://www.bourns.com/docs/Product-Datasheets/SRR1050A.pdf?src-supplier=Digi-Key; ComponentLink2URL: http://www.farnell.com/datasheets/2113225.pdf?src-supplier=Element14; ComponentLink2Description: http://www.farnell.com/datasheets/2113225.pdf?src-supplier=Element14
LED7 = 307: LED, YELLOW, 591NM, 10mA, CLEAR, 0201; ID: 307; MFG: Kingbright; MFG P/N: APG0603SYC-TT; Value: APG0603SYC-TT; EES: 370-00612-00; Status: Released; Package: 0201; Category: LED; RoHS Compliant: Yes; Diode Type: LED; Mounting Type: SMD; Supplier 1: Digi-Key; HelpURL: https://www.digikey.com/product-detail/en/kingbright/APG0603SYC-TT/754-2025-1-ND/6072772; ComponentLink1Description: Datasheet; ComponentLink1URL: http://www.kingbrightusa.com/images/catalog/SPEC/APG0603SYC-TT.pdf; Height: 0.25mm; Supplier Part Number 1: 754-2025-1-ND
LED8 LED9 = 308: LED, ORANGE, 611NM, 10mA, CLEAR, 0201; ID: 308; MFG: Kingbright; MFG P/N: APG0603SEC-TT; Value: APG0603SEC-TT; EES: 370-00613-00; Status: Released; Package: 0201; Category: LED; RoHS Compliant: Yes; Diode Type: LED; Mounting Type: SMD; Supplier 1: Digi-Key; HelpURL: https://www.digikey.com/product-detail/en/kingbright/APG0603SEC-TT/754-2027-1-ND/6072774; ComponentLink1Description: Datasheet; ComponentLink1URL: http://www.kingbrightusa.com/images/catalog/SPEC/APG0603SEC-TT.pdf; Height: 0.25mm; Supplier Part Number 1: 754-2027-1-ND
NT1 = 158: Net Ties, 0402; ID: 158; MFG: _PCB Feature; Status: Released; Category: Net Tie
R55 = 10007: RES, 68.1K, 1%, 1/20W, 0201, AUTOGRADE; ID: 10007; MFG: Panasonic Electronic Components; MFG P/N: ERJ-1GNF6812C; Catagory: Chip Resistor - Surface Mount; Power: 0.05W, 1/20W; EES: 470-18017-00; Status: Released; Package: 0201; Tolerance: 1%; Height: 0.26mm; Supplier 1: Digi-Key; HelpURL: https://www.digikey.in/product-detail/en/panasonic-electronic-components/ERJ-1GNF6812C/P123130CT-ND/8343199; ComponentLink1Description: Datasheet; ComponentLink1URL: https://industrial.panasonic.com/cdbs/www-data/pdf/RDA0000/AOA0000C304.pdf; Supplier Part Number 1: P123130CT-ND
R56 R60 = 6783: as R9 on sheet Processor; Status: Released; Package: 0201; Power: 1/20W; Tolerance: 1%; Height: 0.26mm; Supplier 1: Digi-Key; HelpURL: https://www.digikey.in/product-detail/en/panasonic-electronic-components/ERJ-1GNF1002C/P122414CT-ND/7389440; ComponentLink1Description: Datasheet; ComponentLink1URL: https://industrial.panasonic.com/cdbs/www-data/pdf/RDA0000/AOA0000C304.pdf; LOON: 470-00033-00; Gecko: 470-00033-00; XPN: 470-00033-00; Supplier Part Number 1: P122414CT-ND
R57 R63 = 4161: Resistor, 10.2K Ohms, 0201, 0.05W, ±1%; ID: 4161; MFG: YAGEO; MFG P/N: RC0201FR-0710K2L; Power: 1/20W; COMMON: 470-07513-00; XPN: XS-10018168; Status: Released; Package: 0201; Tolerance: 1%; Height: 0.26mm; Supplier 1: Digi-Key; Supplier Part Number 1: 311-10.2KMCT-ND
R58 = 6790: RES, 1.96K, 1%, 1/20W, 0201; ID: 6790; MFG: PANASONIC; MFG P/N: ERJ1GEF1961C; COMMON: 470-00892-00; PROXY: Alt ID #9405; XPN: XS-10012653; Status: NRND; Package: 0201; Power: 1/20W; Tolerance: 1%
R59 R61 R64 = 10010: as R47 on sheet Trinamic; Status: Released; Package: 0201; Tolerance: 1%; Height: 0.26mm; Supplier 1: Digi-Key; HelpURL: https://www.digikey.in/product-detail/en/bourns-inc/CR0201AFW-1001GLF/118-CR0201AFW-1001GLFCT-ND/12091423; ComponentLink1Description: Datasheet; ComponentLink1URL: https://www.bourns.com/docs/product-datasheets/crxxxxa.pdf; Supplier Part Number 1: 118-CR0201AFW-1001GLFCT-ND
R62 = 4926: Resistor, 86.6K Ohms, 0201, 0.05W, ±1%; ID: 4926; MFG: PANASONIC; MFG P/N: ERJ-1GEF8662C; Power: 1/20W; COMMON: 470-01358-00; Status: NRND; Package: 0201; Tolerance: 1%; Height: 0.26mm; Supplier 1: Digi-Key; XPN: 470-01358-00; Supplier Part Number 1: P86.6KABCT-ND
R77 = 4248: Resistor, 13.3K Ohms, 0201, 0.05W, ±1%; ID: 4248; MFG: PANASONIC; MFG P/N: ERJ-1GEF1332C; Power: 1/20W; COMMON: 470-07589-00; XPN: XS-10018236; Status: NRND; Package: 0201; Tolerance: 1%; Height: 0.26mm; Supplier 1: Digi-Key; Supplier Part Number 1: P13.3KABCT-ND
R78 = 7433: RES, 3.24K, 1%, 1/20W, 0201; ID: 7433; MFG: PANASONIC; MFG P/N: ERJ1GEF3241C; COMMON: 470-01101-00; XPN: XS-10012809; Status: NRND; Package: 0201; Power: 1/20W; Tolerance: 1%
R79 R80 = 8004: as R85 on sheet Trinamic; Status: Released; Package: 0402; Power: 1/16W; Tolerance: JUMPER; XPN: 470-02332-00
R88 = CMP-2002-08122-2: RES Thick Film, 0Ω, 0.063W, 0402; Tolerance: 5%; Max Power Dissipation: 63mW; Voltage Rating: 50V; Temperature Coefficient: 100ppm/°C; Resistance: 0mR; Contact Plating: Tin; Height: 0.35mm; Radiation Hardening: No; Features: Automotive AEC-Q200; Composition: Thick Film; Width: 0.5mm; Weight: 2.3E-05oz; Termination: SMD/SMT; Packaging: Tape and Reel; Mount: Surface Mount; Case Code (Metric): 1005; Military Standard: Not; Min Operating Temperature: -55°C; Number of Terminations: 2; Package Quantity: 1; Case Code (Imperial): 0402; Depth: 0.5mm; Max Operating Temperature: 155°C; Case/Package: 0402; Power Rating: 63mW; Lead Free: Lead Free; Voltage Rating (DC): 50V; Length: 1mm
U7 U9 = TI_TPS54331GDR: Conv DC-DC Single Step Down 3.5V to 28V 8-Pin SOIC T/R; Manufacturer: Texas Instruments; Output Current: 3A; Output Voltage: 25V; Switching Frequency: 570kHz; Number of Outputs: 1; Synchronous Rectifier: No; Quiescent Current: 110uA; Min Output Voltage: 800mV; Output Type: Adjustable; Supplier 1: Digi-Key; Supplier Part Number 1: 296-50099-1-ND; RoHS: Yes; Category: Voltage Regulators - Switching; Stock 1: 2585; Pricing 1: 1=1.85000, 10=1.66300, 25=1.56880, 100=1.33660, 250=1.25504, 500=1.09816, 1000=1.03600 (USD); Case/Package: D; Number of Pins: 8; Min Operating Temperature: -40°C; Max Operating Temperature: 150°C; Package Quantity: 2500; Series: SWIFT™, Eco-Mode™; Packaging: Tape and Reel; Max Output Current: 3A; Max Input Voltage: 28V; Min Input Voltage: 3.5V; Max Output Voltage: 25V; Operating Supply Voltage: 28V; Lead Free: Lead Free; RoHS Compliant: Yes; ComponentLink1URL: https://datasheet.ciiva.com/2034/tps54331-2034843.pdf?src-supplier=Digi-Key; ComponentLink1Description: https://datasheet.ciiva.com/2034/tps54331-2034843.pdf?src-supplier=Digi-Key; ComponentLink2URL: https://datasheet.ciiva.com/14378/tps54331-14378086.pdf?src-supplier=Avnet; ComponentLink2Description: https://datasheet.ciiva.com/14378/tps54331-14378086.pdf?src-supplier=Avnet
U8 = CMP-0394-01493-2: Single Output Fast Transient Response LDO, 250 mA, Fixed 3.3 V Output, 2 to 5.5 V Input, with Ultra-Low IQ, 6-pin WSON (DSE), -40 to 125 degC, Green (RoHS & no Sb/Br); Manufacturer: Texas Instruments; Vin(Min)(V): 2; Rating: Catalog; Vdo(Typ)(mV): 130; Fixed Output Options(V): 3.3; Iq(Typ)(mA): 0.008; SubFamily: Single Channel LDO; Iout(Max)(A): 0.25; Vin(Max)(V): 5.5; ComponentLink1Description: Manufacturer URL; ComponentLink1URL: http://www.ti.com/; PackageVersion: 4207810/A; DatasheetVersion: SBVS128C; Mounting Technology: Surface Mount; Eco-Plan: Green (RoHS & no Sb/Br); Vout Adj(Min)(V): 3.3; ComponentLink3Description: Package Specification; ComponentLink3URL: http://www.ti.com/litv/pdf/mpds287; ComponentLink2Description: Datasheet; PackageReference: DES0006A; ComponentLink2URL: http://www.ti.com/general/docs/lit/getliterature.tsp?genericPartNumber=TPS72733&fileType=pdf; PackageDescription: 6-Pin Plastic Small Outline, Body 1.5 x 1.5 mm, Pitch 0.5 mm; PartNumber: TPS72733DSET; Accuracy(%): 2; Vout Adj(Max)(V): 3.3; Manufacturer Part Number: TPS72733DSET

## Sheet Temperature.SchDoc
size 420 x 297 mm; SheetNumber: 3; SheetTotal: 10; PageSetup: Record=PageOptions|CenterHorizontal=True|CenterVertical=True|PrintScale=0.96|XCorrection=1.00|YCorrection=1.00|PrintKind=1|BorderSize=5000000|LeftOffset=0|BottomOffset=0|Orientation=2|PaperLength=4318|PaperWidth=2794|Scale=100|PaperSource=7|PrintQuality=600|MediaType=1|DitherType=10|PaperKind=11" x 17"|PrintScaleMode=1
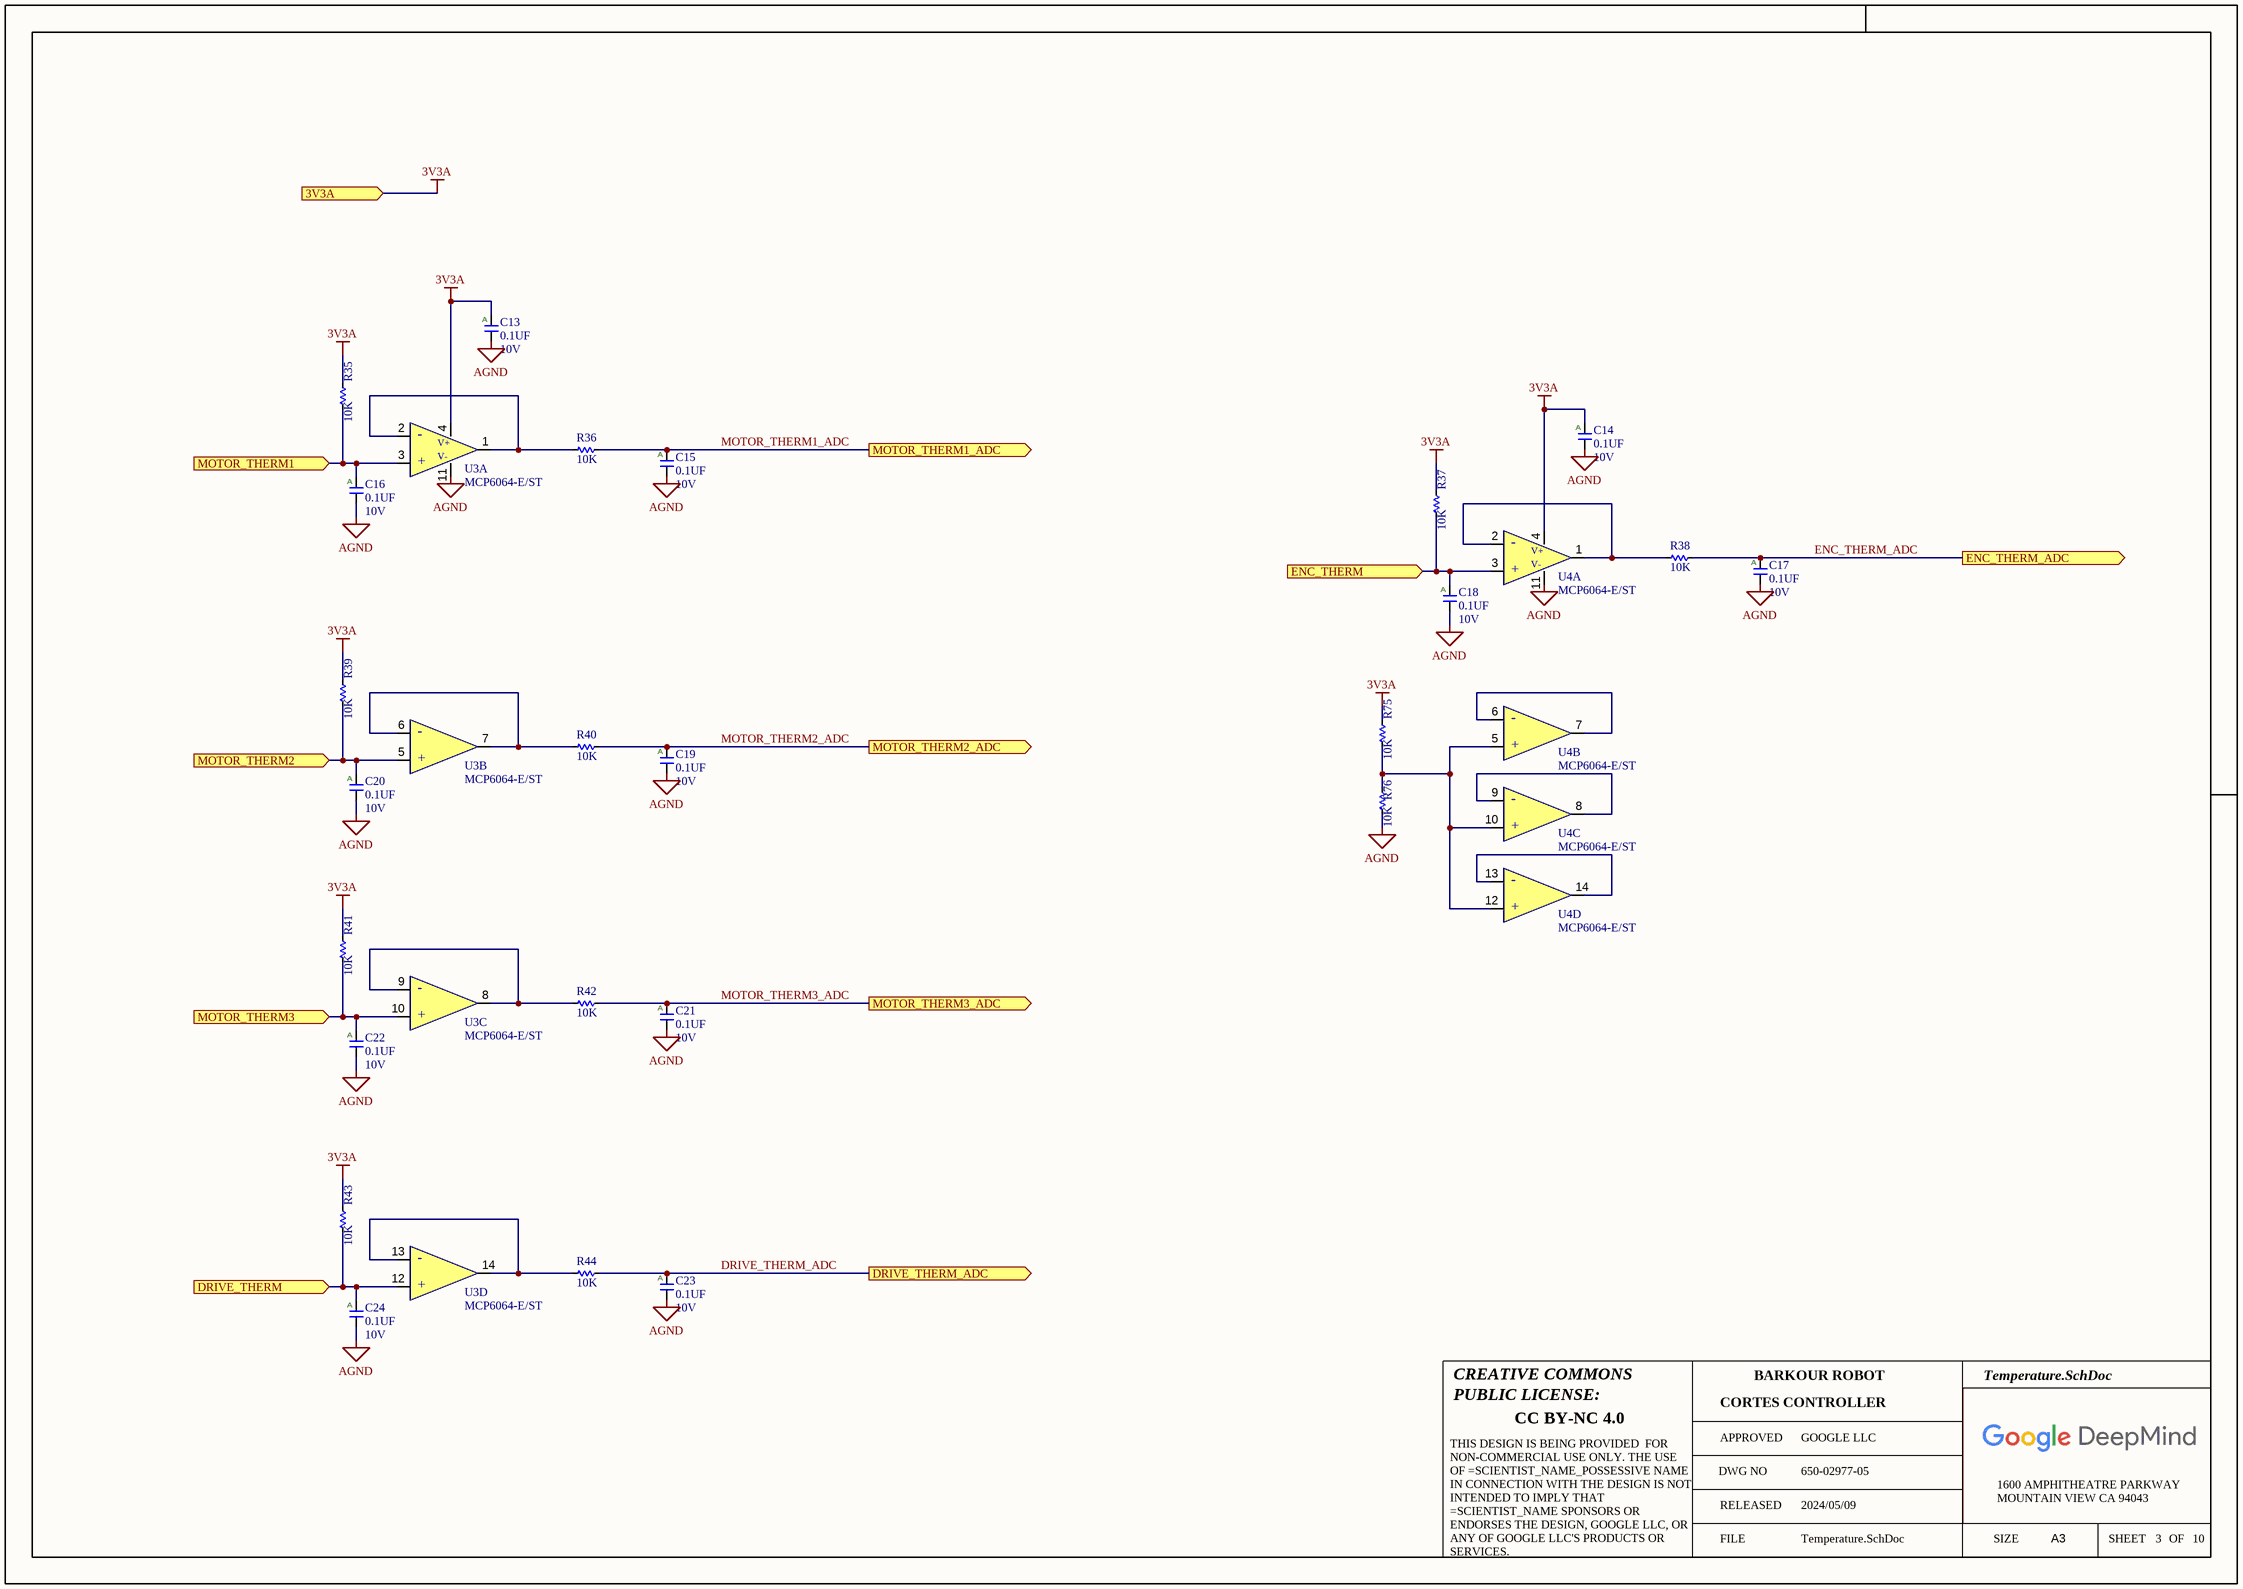
[diagram p6: Temperature.SchDoc]

### Parts
C13  value 0.1UF  Voltage: 10V  [C0201Y]  (hidden comment: __Template_Cap_Auto)
C14  value 0.1UF  Voltage: 10V  [C0201Y]  (hidden comment: __Template_Cap_Auto)
C15  value 0.1UF  Voltage: 10V  [C0201Y]  (hidden comment: __Template_Cap_Auto)
C16  value 0.1UF  Voltage: 10V  [C0201Y]  (hidden comment: __Template_Cap_Auto)
C17  value 0.1UF  Voltage: 10V  [C0201Y]  (hidden comment: __Template_Cap_Auto)
C18  value 0.1UF  Voltage: 10V  [C0201Y]  (hidden comment: __Template_Cap_Auto)
C19  value 0.1UF  Voltage: 10V  [C0201Y]  (hidden comment: __Template_Cap_Auto)
C20  value 0.1UF  Voltage: 10V  [C0201Y]  (hidden comment: __Template_Cap_Auto)
C21  value 0.1UF  Voltage: 10V  [C0201Y]  (hidden comment: __Template_Cap_Auto)
C22  value 0.1UF  Voltage: 10V  [C0201Y]  (hidden comment: __Template_Cap_Auto)
C23  value 0.1UF  Voltage: 10V  [C0201Y]  (hidden comment: __Template_Cap_Auto)
C24  value 0.1UF  Voltage: 10V  [C0201Y]  (hidden comment: __Template_Cap_Auto)
R35  value 10K  [R0201_H0.26MM]  (hidden comment: __Template_Resistor)
R36  value 10K  [R0201_H0.26MM]  (hidden comment: __Template_Resistor)
R37  value 10K  [R0201_H0.26MM]  (hidden comment: __Template_Resistor)
R38  value 10K  [R0201_H0.26MM]  (hidden comment: __Template_Resistor)
R39  value 10K  [R0201_H0.26MM]  (hidden comment: __Template_Resistor)
R40  value 10K  [R0201_H0.26MM]  (hidden comment: __Template_Resistor)
R41  value 10K  [R0201_H0.26MM]  (hidden comment: __Template_Resistor)
R42  value 10K  [R0201_H0.26MM]  (hidden comment: __Template_Resistor)
R43  value 10K  [R0201_H0.26MM]  (hidden comment: __Template_Resistor)
R44  value 10K  [R0201_H0.26MM]  (hidden comment: __Template_Resistor)
R75  value 10K  [R0201_H0.26MM]  (hidden comment: __Template_Resistor)
R76  value 10K  [R0201_H0.26MM]  (hidden comment: __Template_Resistor)
U3  Manufacturer Part Number: MCP6064-E/ST  [14TSSOP65]  (hidden comment: MCP6064)  (parts A,B,C,D of 4)
U4  Manufacturer Part Number: MCP6064-E/ST  [14TSSOP65]  (hidden comment: MCP6064)  (parts A,B,C,D of 4)

### Ports
3V3A (in), DRIVE_THERM (in), DRIVE_THERM_ADC (out), ENC_THERM (in), ENC_THERM_ADC (out), MOTOR_THERM1 (in), MOTOR_THERM1_ADC (out), MOTOR_THERM2 (in), MOTOR_THERM2_ADC (out), MOTOR_THERM3 (in), MOTOR_THERM3_ADC (out)

### Nets
3V3A: C13.1 C14.1 R35.2 R37.2 R39.2 R41.2 R43.2 R75.2 U3.4 U4.4 ; port 3V3A
AGND: C13.2 C14.2 C15.2 C16.2 C17.2 C18.2 C19.2 C20.2 C21.2 C22.2 C23.2 C24.2 R76.1 U3.11 U4.11
DRIVE_THERM: C24.1 R43.1 U3.12 ; port DRIVE_THERM
DRIVE_THERM_ADC: C23.1 R44.2 ; port DRIVE_THERM_ADC
ENC_THERM_ADC: C17.1 R38.2 ; port ENC_THERM_ADC
MOTOR_THERM1: C16.1 R35.1 U3.3 ; port MOTOR_THERM1
MOTOR_THERM1_ADC: C15.1 R36.2 ; port MOTOR_THERM1_ADC
MOTOR_THERM2: C20.1 R39.1 U3.5 ; port MOTOR_THERM2
MOTOR_THERM2_ADC: C19.1 R40.2 ; port MOTOR_THERM2_ADC
MOTOR_THERM3: C22.1 R41.1 U3.10 ; port MOTOR_THERM3
MOTOR_THERM3_ADC: C21.1 R42.2 ; port MOTOR_THERM3_ADC
NetC18_1: C18.1 R37.1 U4.3 ; port ENC_THERM
NetR36_1: R36.1 U3.1 U3.2
NetR38_1: R38.1 U4.1 U4.2
NetR40_1: R40.1 U3.6 U3.7
NetR42_1: R42.1 U3.8 U3.9
NetR44_1: R44.1 U3.13 U3.14
NetR75_1: R75.1 R76.2 U4.5 U4.10 U4.12
NetU4_6: U4.6 U4.7
NetU4_8: U4.8 U4.9
NetU4_13: U4.13 U4.14

### Notes on the sheet
- CREATIVE COMMONS
- PUBLIC LICENSE:
- BARKOUR ROBOT
- CC BY-NC 4.0
- APPROVED
- DWG NO
- GOOGLE LLC
- FILE
- RELEASED
- 2024/05/09
- SIZE
- 1600 AMPHITHEATRE PARKWAY
- MOUNTAIN VIEW CA 94043
- A3
- SHEET
- OF
- THIS DESIGN IS BEING PROVIDED  FOR NON-COMMERCIAL USE ONLY. THE USE OF =SCIENTIST_NAME_POSSESSIVE NAME IN CONNECTION WITH THE DESIGN IS NOT INTENDED TO IMPLY THAT =SCIENTIST_NAME SPONSORS OR ENDORSES THE DESIGN, GOOGLE LLC, OR ANY OF GOOGLE LLC'S PRODUCTS OR SERVICES.
- (in symbol 934) A
- (in symbol MICROCHIP_MCP6064, part A) -; V+; V-; +
- (in symbol MICROCHIP_MCP6064, part B) -; +
- (in symbol MICROCHIP_MCP6064, part C) -; +
- (in symbol MICROCHIP_MCP6064, part D) -; +

### Library data of the parts
C13-C24 = 934: CAP, CER, X6S, 0.1uF, 10V, 10%, 0201, AUTOGRADE; ID: 934; MFG: MURATA; MFG P/N: GRT033C81A104KE01D; XPN: 150-01178-00; Gecko: 150-04546-00; EES: 150-04563-00; Status: Released; Package: 0201; Dielectric: X6S; Tolerance: 10%; Height: 0.33mm T; Supplier 1: Digi-key; HelpURL: https://www.digikey.com/product-detail/en/murata-electronics/GRT033C81A104KE01D/490-12232-1-ND/5416933; ComponentLink1Description: Datasheet; ComponentLink1URL: https://search.murata.co.jp/Ceramy/image/img/A01X/G101/ENG/GRT033C81A104KE01-01.pdf; COMMON: 150-01178-00; LOON: 150-01178-00; Supplier Part Number 1: 490-12232-1-ND
R35-R44 R75 R76 = 6783: RES, 10K, 1%, 1/20W, 0201, AUTOGRADE; ID: 6783; MFG: PANASONIC; MFG P/N: ERJ1GNF1002C; COMMON: 470-00033-00; PROXY: Use ID #4151; EES: 470-18014-00; Status: Released; Package: 0201; Power: 1/20W; Tolerance: 1%; Height: 0.26mm; Supplier 1: Digi-Key; HelpURL: https://www.digikey.in/product-detail/en/panasonic-electronic-components/ERJ-1GNF1002C/P122414CT-ND/7389440; ComponentLink1Description: Datasheet; ComponentLink1URL: https://industrial.panasonic.com/cdbs/www-data/pdf/RDA0000/AOA0000C304.pdf; LOON: 470-00033-00; Gecko: 470-00033-00; XPN: 470-00033-00; Supplier Part Number 1: P122414CT-ND
U3 U4 = MICROCHIP_MCP6064: Microchip MCP6064-E/ST; Quad Op Amp; 0.73MHz CMOS; Rail to Rail; 3V; 5V; 14-Pin TSSOP; Min Supply Voltage: 1.8V; Max Supply Voltage: 6V; Voltage Gain: 115dB; Common Mode Rejection Ratio: 72dB; Gain Bandwidth Product: 730kHz; Number of Channels: 4; Output Current: 27mA; Slew Rate: 0.25V/µs; Nominal Supply Current: 60uA; Input Bias Current: 100pA; Input Offset Voltage (Vos): 150uV; Power Supply Rejection Ratio (PSRR): 70dB; Amplifier Type: GENERAL PURPOSE; ComponentLink1URL: http://www.microchip.com/mymicrochip/filehandler.aspx?ddocname=en528763; ComponentLink1Description: http://www.microchip.com/mymicrochip/filehandler.aspx?ddocname=en528763; Supplier 1: Digi-Key; Supplier Part Number 1: MCP6064-E/ST-ND; Manufacturer: Microchip; RoHS: Yes; Category: Amplifiers - Op Amps, Buffer, Instrumentation; Stock 1: 117; Pricing 1: 1=1.83000, 25=1.52640, 100=1.42500 (USD); Mount: Surface Mount; Case/Package: TSSOP; Number of Pins: 14; Min Operating Temperature: -40°C; Max Operating Temperature: 125°C; Package Quantity: 96; Packaging: Rail/Tube; Bandwidth: 730kHz; Unity Gain Bandwidth Product: 730kHz; Number of Circuits: 4; Operating Supply Current: 60uA; Output Current per Channel: 27mA; Number of Elements: 4; Number of Amplifiers: 4; Supply Current: 60uA; Technology: CMOS; Input Offset Voltage-Max: 150uV; Slew Rate-Nom: 0.25V/µs; Length: 5mm; Width: 4.4mm; Height: 1mm; Radiation Hardening: No; REACH SVHC: No SVHC; Lead Free: Lead Free; RoHS Compliant: Yes; ComponentLink2URL: https://datasheet.ciiva.com/8078/mcp6061-ds22189b-8078832.pdf?src-supplier=Element14; ComponentLink2Description: https://datasheet.ciiva.com/8078/mcp6061-ds22189b-8078832.pdf?src-supplier=Element14; ComponentLink3URL: https://datasheet.ciiva.com/1802/mcp6061-ds22189b-1802877.pdf?src-supplier=Digi-Key; ComponentLink3Description: https://datasheet.ciiva.com/1802/mcp6061-ds22189b-1802877.pdf?src-supplier=Digi-Key; ComponentLink4URL: https://datasheet.ciiva.com/11707/jp542225-11707116.pdf?src-supplier=Avnet; ComponentLink4Description: https://datasheet.ciiva.com/11707/jp542225-11707116.pdf?src-supplier=Avnet; ComponentLink5URL: https://datasheet.ciiva.com/5777/1062687-5777669.pdf?src-supplier=Farnell; ComponentLink5Description: https://datasheet.ciiva.com/5777/1062687-5777669.pdf?src-supplier=Farnell; ComponentLink6URL: https://datasheet.ciiva.com/16348/filehandler-aspxddocname-en542225-16348939.pdf?src-supplier=Future+Electronics; ComponentLink6Description: https://datasheet.ciiva.com/16348/filehandler-aspxddocname-en542225-16348939.pdf?src-supplier=Future+Electronics

## Sheet Microphone.SchDoc
size 420 x 297 mm; SheetNumber: 5; SheetTotal: 10; PageSetup: Record=PageOptions|CenterHorizontal=True|CenterVertical=True|PrintScale=0.96|XCorrection=1.00|YCorrection=1.00|PrintKind=1|BorderSize=5000000|LeftOffset=0|BottomOffset=0|Orientation=2|PaperLength=4318|PaperWidth=2794|Scale=100|PaperSource=7|PrintQuality=600|MediaType=1|DitherType=10|PaperKind=11" x 17"|PrintScaleMode=1
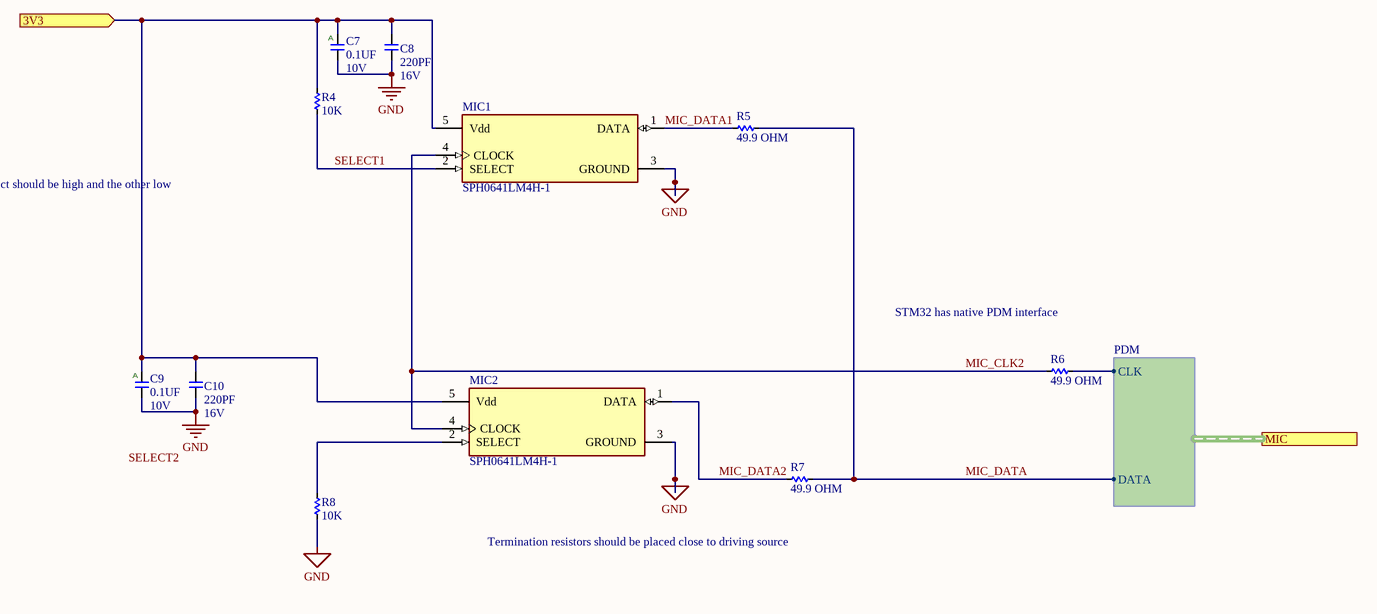
[diagram p7: Microphone.SchDoc]

### Parts
C7  value 0.1UF  Voltage: 10V  [C0201Y]  (hidden comment: __Template_Cap_Auto)
C8  value 220PF  Voltage: 16V  [C0201Y]  (hidden comment: __Template_Cap)
C9  value 0.1UF  Voltage: 10V  [C0201Y]  (hidden comment: __Template_Cap_Auto)
C10  value 220PF  Voltage: 16V  [C0201Y]  (hidden comment: __Template_Cap)
MIC1  SPH0641LM4H-1  [FP-SPH0641LM4H-1-MFG]
MIC2  SPH0641LM4H-1  [FP-SPH0641LM4H-1-MFG]
R4  value 10K  [R0201_H0.26MM]  (hidden comment: __Template_Resistor)
R5  value 49.9 OHM  [R0201_H0.26MM]  (hidden comment: __Template_Resistor)
R6  value 49.9 OHM  [R0201_H0.26MM]  (hidden comment: __Template_Resistor)
R7  value 49.9 OHM  [R0201_H0.26MM]  (hidden comment: __Template_Resistor)
R8  value 10K  [R0201_H0.26MM]  (hidden comment: __Template_Resistor)

### Ports
3V3 (in), MIC (harness PDM)

### Harnesses
PDM: DATA, CLK

### Nets
3V3: C7.1 C8.1 C9.1 C10.1 MIC1.5(Vdd) MIC2.5(Vdd) R4.2 ; port 3V3
GND: C7.2 C8.2 C9.2 C10.2 MIC1.3(GROUND) MIC2.3(GROUND) R8.1
MIC_CLK: R6.2 ; port MIC.CLK
MIC_CLK2: MIC1.4(CLOCK) MIC2.4(CLOCK) R6.1
MIC_DATA: R5.2 R7.2 ; port MIC.DATA
MIC_DATA1: MIC1.1(DATA) R5.1
MIC_DATA2: MIC2.1(DATA) R7.1
SELECT1: MIC1.2(SELECT) R4.1
NetMIC2_2: MIC2.2(SELECT) R8.2

### Notes on the sheet
- (near MIC1) One Select should be high and the other low
- STM32 has native PDM interface
- Termination resistors should be placed close to driving source
- Labels drawn without touching a wire or pin: SELECT2
- CREATIVE COMMONS
- PUBLIC LICENSE:
- BARKOUR ROBOT
- CC BY-NC 4.0
- APPROVED
- DWG NO
- GOOGLE LLC
- FILE
- RELEASED
- 2024/05/09
- SIZE
- 1600 AMPHITHEATRE PARKWAY
- MOUNTAIN VIEW CA 94043
- A3
- SHEET
- OF
- THIS DESIGN IS BEING PROVIDED  FOR NON-COMMERCIAL USE ONLY. THE USE OF =SCIENTIST_NAME_POSSESSIVE NAME IN CONNECTION WITH THE DESIGN IS NOT INTENDED TO IMPLY THAT =SCIENTIST_NAME SPONSORS OR ENDORSES THE DESIGN, GOOGLE LLC, OR ANY OF GOOGLE LLC'S PRODUCTS OR SERVICES.
- (in symbol 934) A

### Library data of the parts
C7 C9 = 934: as C13-C24 on sheet Temperature; Status: Released; Package: 0201; Dielectric: X6S; Tolerance: 10%; Height: 0.33mm T; Supplier 1: Digi-key; HelpURL: https://www.digikey.com/product-detail/en/murata-electronics/GRT033C81A104KE01D/490-12232-1-ND/5416933; ComponentLink1Description: Datasheet; ComponentLink1URL: https://search.murata.co.jp/Ceramy/image/img/A01X/G101/ENG/GRT033C81A104KE01-01.pdf; COMMON: 150-01178-00; LOON: 150-01178-00; Supplier Part Number 1: 490-12232-1-ND
C8 C10 = 156: CAP, CER, X7R, 220pF, 16V, 10%, 0201, 0.33mm T; ID: 156; MFG: MURATA; MFG P/N: GRM033R71C221KA01D; XPN: 150-00794-00; EES: 150-04568-00; Status: Released; Package: 0201; Dielectric: X7R; Tolerance: 10%; Height: 0.33mm T; ComponentLink1Description: Datasheet; COMMON: 150-00794-00; LOON: 150-00794-00; Gecko: 150-00794-00
MIC1 MIC2 = CMP-95043-000005-1: MORELLO MIC MULTIMODE DGT BOT PT; Operating Supply Current: 700uA; Direction: Omnidirectional; Output Type: Digital; Shape: Rectangular; Height: 1.08mm; Series: SiSonic™ SPH; Packaging: Cut Tape; Termination: Solder; Width: 2.65mm; RoHS Compliant: Yes; Length: 3.5mm
R4 R8 = 6783: as R35-R44 on sheet Temperature; Status: Released; Package: 0201; Power: 1/20W; Tolerance: 1%; Height: 0.26mm; Supplier 1: Digi-Key; HelpURL: https://www.digikey.in/product-detail/en/panasonic-electronic-components/ERJ-1GNF1002C/P122414CT-ND/7389440; ComponentLink1Description: Datasheet; ComponentLink1URL: https://industrial.panasonic.com/cdbs/www-data/pdf/RDA0000/AOA0000C304.pdf; LOON: 470-00033-00; Gecko: 470-00033-00; XPN: 470-00033-00; Supplier Part Number 1: P122414CT-ND
R5-R7 = 10006: RES, 49.9, 1%, 1/20W, 0201, AUTOGRADE; ID: 10006; MFG: Panasonic Electronic Components; MFG P/N: ERJ-1GNF49R9C; Catagory: Chip Resistor - Surface Mount; Power: 0.05W, 1/20W; EES: 470-18006-00; Status: Released; Package: 0201; Tolerance: 1%; Height: 0.26mm; Supplier 1: Digi-Key; HelpURL: https://www.digikey.in/product-detail/en/panasonic-electronic-components/ERJ-1GNF49R9C/P123049CT-ND/8343037; ComponentLink1Description: Datasheet; ComponentLink1URL: https://industrial.panasonic.com/cdbs/www-data/pdf/RDA0000/AOA0000C304.pdf; Supplier Part Number 1: P123049CT-ND